# Altium project roach2_project rev2.PrjPCB (part 9 of 13)

## Sheet v6_io_27_28_32_33.SchDoc: Virtex-6 IO Banks 27, 28, 32 & 33
size A3; Date: DO NOT USE, RATHER USE PROJ OPTIONS; DrawnBy: DO NOT USE, RATHER USE PROJ OPTIONS; Engineer: DO NOT USE, RATHER USE PROJ OPTIONS; Organization: DO NOT USE, RATHER USE PROJ OPTIONS; DocumentNumber: DO NOT USE, RATHER USE PROJ OPTIONS; Revision: DO NOT USE, RATHER USE PROJ OPTIONS; SheetNumber: 16; SheetTotal: 27; SCH_Sheet_Filename: v6_io_27_28_32_33.SchDoc; CurrentTime: DO NOT USE, RATHER USE PROJ OPTIONS; Time: DO NOT USE, RATHER USE PROJ OPTIONS; DocumentFullPathAndName: DO NOT USE, RATHER USE PROJ OPTIONS; DocumentName: DO NOT USE, RATHER USE PROJ OPTIONS; ModifiedDate: DO NOT USE, RATHER USE PROJ OPTIONS; ImagePath: DO NOT USE, RATHER USE PROJ OPTIONS
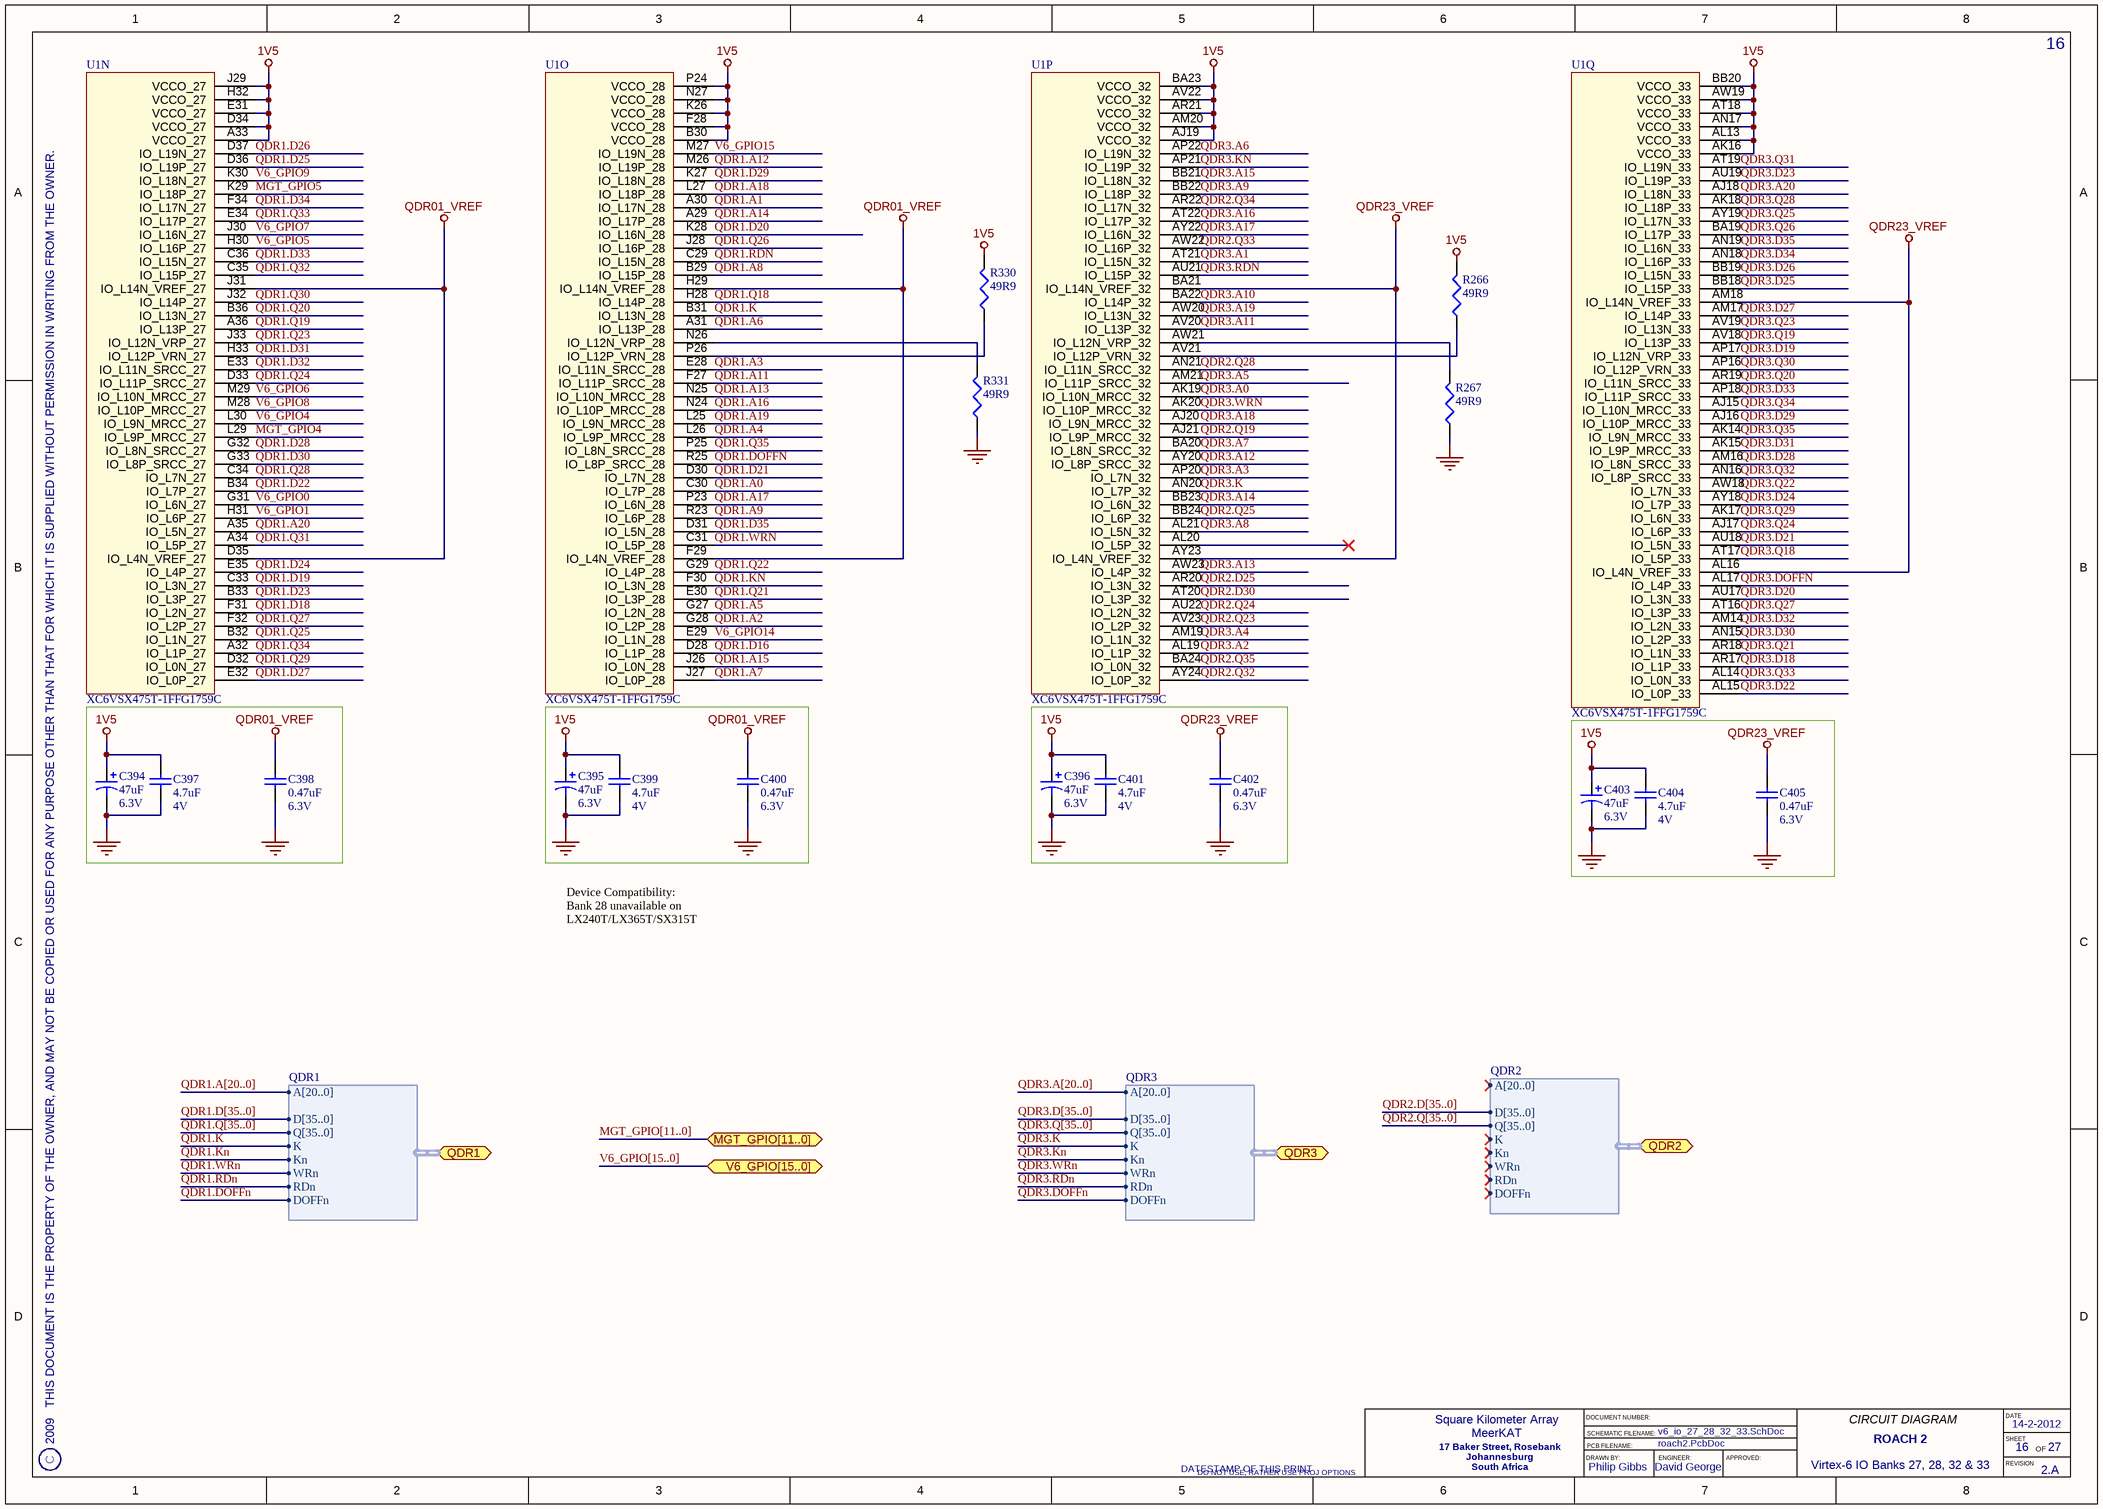
[diagram p16: v6_io_27_28_32_33.SchDoc]

### Parts
C394  Rating: 6.3V  [CAPMP3528X120L]  (hidden comment: 47uF)
C395  Rating: 6.3V  [CAPMP3528X120L]  (hidden comment: 47uF)
C396  Rating: 6.3V  [CAPMP3528X120L]  (hidden comment: 47uF)
C397  Rating: 4V  [CAPC1005X60L]  (hidden comment: 4.7uF)
C398  Rating: 6.3V  [CAPC1005X55L]  (hidden comment: 0.47uF)
C399  Rating: 4V  [CAPC1005X60L]  (hidden comment: 4.7uF)
C400  Rating: 6.3V  [CAPC1005X55L]  (hidden comment: 0.47uF)
C401  Rating: 4V  [CAPC1005X60L]  (hidden comment: 4.7uF)
C402  Rating: 6.3V  [CAPC1005X55L]  (hidden comment: 0.47uF)
C403  Rating: 6.3V  [CAPMP3528X120L]  (hidden comment: 47uF)
C404  Rating: 4V  [CAPC1005X60L]  (hidden comment: 4.7uF)
C405  Rating: 6.3V  [CAPC1005X55L]  (hidden comment: 0.47uF)
R266  49R9  [RESC1005X40L]
R267  49R9  [RESC1005X40L]
R330  49R9  [RESC1005X40L]
R331  49R9  [RESC1005X40L]
U1  XC6VSX475T-1FFG1759C  [FFG1759]  (parts N,O,P,Q of 39)

### Ports
MGT_GPIO[11..0] (bidir), QDR1 (harness QDR1), QDR2 (harness QDR2), QDR3 (harness QDR3), V6_GPIO[15..0] (bidir)

### Harnesses
QDR1: A[20..0], D[35..0], Q[35..0], K, Kn, WRn, RDn, DOFFn
QDR3: A[20..0], D[35..0], Q[35..0], K, Kn, WRn, RDn, DOFFn
QDR2: A[20..0], D[35..0], Q[35..0], K, Kn, WRn, RDn, DOFFn

### Nets
1V5: C394.1 C395.1 C396.1 C397.2 C399.2 C401.2 C403.1 C404.2 R266.2 R330.2 U1.A33(VCCO_27) U1.AJ19(VCCO_32) U1.AK16(VCCO_33) U1.AL13(VCCO_33) U1.AM20(VCCO_32) U1.AN17(VCCO_33) U1.AR21(VCCO_32) U1.AT18(VCCO_33) U1.AV22(VCCO_32) U1.AW19(VCCO_33) U1.B30(VCCO_28) U1.BA23(VCCO_32) U1.BB20(VCCO_33) U1.D34(VCCO_27) U1.E31(VCCO_27) U1.F28(VCCO_28) U1.H32(VCCO_27) U1.J29(VCCO_27) U1.K26(VCCO_28) U1.N27(VCCO_28) U1.P24(VCCO_28)
GND: C394.2 C395.2 C396.2 C397.1 C398.1 C399.1 C400.1 C401.1 C402.1 C403.2 C404.1 C405.1 R267.1 R331.1
QDR01_VREF: C398.2 C400.2 U1.D35(IO_L4N_VREF_27) U1.F29(IO_L4N_VREF_28) U1.H29(IO_L14N_VREF_28) U1.J31(IO_L14N_VREF_27)
QDR23_VREF: C402.2 C405.2 U1.AL16(IO_L4N_VREF_33) U1.AM18(IO_L14N_VREF_33) U1.AY23(IO_L4N_VREF_32) U1.BA21(IO_L14N_VREF_32)
MGT_GPIO4: U1.L29(IO_L9P_MRCC_27)
MGT_GPIO5: U1.K29(IO_L18P_27)
QDR1.A0: U1.C30(IO_L7P_28)
QDR1.A1: U1.A30(IO_L17N_28)
QDR1.A2: U1.G28(IO_L2P_28)
QDR1.A3: U1.E28(IO_L11N_SRCC_28)
QDR1.A4: U1.L26(IO_L9P_MRCC_28)
QDR1.A5: U1.G27(IO_L2N_28)
QDR1.A6: U1.A31(IO_L13P_28)
QDR1.A7: U1.J27(IO_L0P_28)
QDR1.A8: U1.B29(IO_L15P_28)
QDR1.A9: U1.R23(IO_L6P_28)
QDR1.A11: U1.F27(IO_L11P_SRCC_28)
QDR1.A12: U1.M26(IO_L19P_28)
QDR1.A13: U1.N25(IO_L10N_MRCC_28)
QDR1.A14: U1.A29(IO_L17P_28)
QDR1.A15: U1.J26(IO_L0N_28)
QDR1.A16: U1.N24(IO_L10P_MRCC_28)
QDR1.A17: U1.P23(IO_L6N_28)
QDR1.A18: U1.L27(IO_L18P_28)
QDR1.A19: U1.L25(IO_L9N_MRCC_28)
QDR1.A20: U1.A35(IO_L5N_27)
QDR1.D16: U1.D28(IO_L1P_28)
QDR1.D18: U1.F31(IO_L2N_27)
QDR1.D19: U1.C33(IO_L3N_27)
QDR1.D20: U1.K28(IO_L16N_28)
QDR1.D21: U1.D30(IO_L7N_28)
QDR1.D22: U1.B34(IO_L7P_27)
QDR1.D23: U1.B33(IO_L3P_27)
QDR1.D24: U1.E35(IO_L4P_27)
QDR1.D25: U1.D36(IO_L19P_27)
QDR1.D26: U1.D37(IO_L19N_27)
QDR1.D27: U1.E32(IO_L0P_27)
QDR1.D28: U1.G32(IO_L8N_SRCC_27)
QDR1.D29: U1.K27(IO_L18N_28)
QDR1.D30: U1.G33(IO_L8P_SRCC_27)
QDR1.D31: U1.H33(IO_L12P_VRN_27)
QDR1.D32: U1.E33(IO_L11N_SRCC_27)
QDR1.D33: U1.C36(IO_L15N_27)
QDR1.D34: U1.F34(IO_L17N_27)
QDR1.D35: U1.D31(IO_L5N_28)
QDR1.DOFFn: U1.R25(IO_L8P_SRCC_28) ; port QDR1.DOFFn
QDR1.K: U1.B31(IO_L13N_28) ; port QDR1.K
QDR1.Kn: U1.F30(IO_L3N_28) ; port QDR1.Kn
QDR1.Q18: U1.H28(IO_L14P_28)
QDR1.Q19: U1.A36(IO_L13P_27)
QDR1.Q20: U1.B36(IO_L13N_27)
QDR1.Q21: U1.E30(IO_L3P_28)
QDR1.Q22: U1.G29(IO_L4P_28)
QDR1.Q23: U1.J33(IO_L12N_VRP_27)
QDR1.Q24: U1.D33(IO_L11P_SRCC_27)
QDR1.Q25: U1.B32(IO_L1N_27)
QDR1.Q26: U1.J28(IO_L16P_28)
QDR1.Q27: U1.F32(IO_L2P_27)
QDR1.Q28: U1.C34(IO_L7N_27)
QDR1.Q29: U1.D32(IO_L0N_27)
QDR1.Q30: U1.J32(IO_L14P_27)
QDR1.Q31: U1.A34(IO_L5P_27)
QDR1.Q32: U1.C35(IO_L15P_27)
QDR1.Q33: U1.E34(IO_L17P_27)
QDR1.Q34: U1.A32(IO_L1P_27)
QDR1.Q35: U1.P25(IO_L8N_SRCC_28)
QDR1.RDn: U1.C29(IO_L15N_28) ; port QDR1.RDn
QDR1.WRn: U1.C31(IO_L5P_28) ; port QDR1.WRn
QDR2.D25: U1.AR20(IO_L3N_32)
QDR2.D30: U1.AT20(IO_L3P_32)
QDR2.Q19: U1.AJ21(IO_L9P_MRCC_32)
QDR2.Q23: U1.AV23(IO_L2P_32)
QDR2.Q24: U1.AU22(IO_L2N_32)
QDR2.Q25: U1.BB24(IO_L6P_32)
QDR2.Q28: U1.AN21(IO_L11N_SRCC_32)
QDR2.Q32: U1.AY24(IO_L0P_32)
QDR2.Q33: U1.AW22(IO_L16P_32)
QDR2.Q34: U1.AR22(IO_L17N_32)
QDR2.Q35: U1.BA24(IO_L0N_32)
QDR3.A0: U1.AK19(IO_L10N_MRCC_32)
QDR3.A1: U1.AT21(IO_L15N_32)
QDR3.A2: U1.AL19(IO_L1P_32)
QDR3.A3: U1.AP20(IO_L7N_32)
QDR3.A4: U1.AM19(IO_L1N_32)
QDR3.A5: U1.AM21(IO_L11P_SRCC_32)
QDR3.A6: U1.AP22(IO_L19N_32)
QDR3.A7: U1.BA20(IO_L8N_SRCC_32)
QDR3.A8: U1.AL21(IO_L5N_32)
QDR3.A9: U1.BB22(IO_L18P_32)
QDR3.A10: U1.BA22(IO_L14P_32)
QDR3.A11: U1.AV20(IO_L13P_32)
QDR3.A12: U1.AY20(IO_L8P_SRCC_32)
QDR3.A13: U1.AW23(IO_L4P_32)
QDR3.A14: U1.BB23(IO_L6N_32)
QDR3.A15: U1.BB21(IO_L18N_32)
QDR3.A16: U1.AT22(IO_L17P_32)
QDR3.A17: U1.AY22(IO_L16N_32)
QDR3.A18: U1.AJ20(IO_L9N_MRCC_32)
QDR3.A19: U1.AW20(IO_L13N_32)
QDR3.A20: U1.AJ18(IO_L18N_33)
QDR3.D18: U1.AR17(IO_L1P_33)
QDR3.D19: U1.AP17(IO_L12N_VRP_33)
QDR3.D20: U1.AU17(IO_L3N_33)
QDR3.D21: U1.AU18(IO_L5N_33)
QDR3.D22: U1.AL15(IO_L0P_33)
QDR3.D23: U1.AU19(IO_L19P_33)
QDR3.D24: U1.AY18(IO_L7P_33)
QDR3.D25: U1.BB18(IO_L15P_33)
QDR3.D26: U1.BB19(IO_L15N_33)
QDR3.D27: U1.AM17(IO_L14P_33)
QDR3.D28: U1.AM16(IO_L8N_SRCC_33)
QDR3.D29: U1.AJ16(IO_L10P_MRCC_33)
QDR3.D30: U1.AN15(IO_L2P_33)
QDR3.D31: U1.AK15(IO_L9P_MRCC_33)
QDR3.D32: U1.AM14(IO_L2N_33)
QDR3.D33: U1.AP18(IO_L11P_SRCC_33)
QDR3.D34: U1.AN18(IO_L16P_33)
QDR3.D35: U1.AN19(IO_L16N_33)
QDR3.DOFFn: U1.AL17(IO_L4P_33) ; port QDR3.DOFFn
QDR3.K: U1.AN20(IO_L7P_32) ; port QDR3.K
QDR3.Kn: U1.AP21(IO_L19P_32) ; port QDR3.Kn
QDR3.Q18: U1.AT17(IO_L5P_33)
QDR3.Q19: U1.AV18(IO_L13P_33)
QDR3.Q20: U1.AR19(IO_L11N_SRCC_33)
QDR3.Q21: U1.AR18(IO_L1N_33)
QDR3.Q22: U1.AW18(IO_L7N_33)
QDR3.Q23: U1.AV19(IO_L13N_33)
QDR3.Q24: U1.AJ17(IO_L6P_33)
QDR3.Q25: U1.AY19(IO_L17N_33)
QDR3.Q26: U1.BA19(IO_L17P_33)
QDR3.Q27: U1.AT16(IO_L3P_33)
QDR3.Q28: U1.AK18(IO_L18P_33)
QDR3.Q29: U1.AK17(IO_L6N_33)
QDR3.Q30: U1.AP16(IO_L12P_VRN_33)
QDR3.Q31: U1.AT19(IO_L19N_33)
QDR3.Q32: U1.AN16(IO_L8P_SRCC_33)
QDR3.Q33: U1.AL14(IO_L0N_33)
QDR3.Q34: U1.AJ15(IO_L10N_MRCC_33)
QDR3.Q35: U1.AK14(IO_L9N_MRCC_33)
QDR3.RDn: U1.AU21(IO_L15P_32) ; port QDR3.RDn
QDR3.WRn: U1.AK20(IO_L10P_MRCC_32) ; port QDR3.WRn
V6_GPIO0: U1.G31(IO_L6N_27)
V6_GPIO1: U1.H31(IO_L6P_27)
V6_GPIO4: U1.L30(IO_L9N_MRCC_27)
V6_GPIO5: U1.H30(IO_L16P_27)
V6_GPIO6: U1.M29(IO_L10N_MRCC_27)
V6_GPIO7: U1.J30(IO_L16N_27)
V6_GPIO8: U1.M28(IO_L10P_MRCC_27)
V6_GPIO9: U1.K30(IO_L18N_27)
V6_GPIO14: U1.E29(IO_L1N_28)
V6_GPIO15: U1.M27(IO_L19N_28)
NetR266_1: R266.1 U1.AV21(IO_L12P_VRN_32)
NetR267_2: R267.2 U1.AW21(IO_L12N_VRP_32)
NetR330_1: R330.1 U1.P26(IO_L12P_VRN_28)
NetR331_2: R331.2 U1.N26(IO_L12N_VRP_28)

Not connected (* = marked no-connect by the designer): U1 AL20(IO_L5P_32)*

### Buses and harness runs
bus MGT_GPIO[11..0] = port MGT_GPIO[11..0]
bus QDR1.A[20..0]
bus QDR1.D[35..0]
bus QDR1.Q[35..0]
bus QDR2.D[35..0]
bus QDR2.Q[35..0]
bus QDR3.A[20..0]
bus QDR3.D[35..0]
bus QDR3.Q[35..0]
bus V6_GPIO[15..0] = port V6_GPIO[15..0]

### Notes on the sheet
- Device Compatibility:
  Bank 28 unavailable on LX240T/LX365T/SX315T
- 2009   THIS DOCUMENT IS THE PROPERTY OF THE OWNER, AND MAY NOT BE COPIED OR USED FOR ANY PURPOSE OTHER THAN THAT FOR WHICH IT IS SUPPLIED WITHOUT PERMISSION IN WRITING FROM THE OWNER.
- C
- DATESTAMP OF THIS PRINT
- DRAWN BY:
- DOCUMENT NUMBER:
- SCHEMATIC FILENAME:
- PCB FILENAME:
- ENGINEER:
- APPROVED:
- CIRCUIT DIAGRAM
- DATE
- SHEET
- REVISION
- OF

### Library data of the parts
C394-C396 C403 = CAP-TAN-1: 47uF, Conductive Polymer Chip Capacitor; Manufacturer: KEMET; PartNum: T520T476M006ATE070; Tolerance: 20%; ESR: 0.07; POD number: CAP-TAN-1; Value: 47uF; RoHS: Y; Sort Value: 47; Category: Capacitors; Subcategory: Tantalum
C397 C399 C401 C404 = CAP-CER-11: 4.7uF, Ceramic Capacitor; Manufacturer: MURATA; PartNum: AMK105BJ475MV-F; Tolerance: 20%; Dielectric: X5R; POD number: CAP-CER-11; Value: 4.7uF; RoHS: Y; Sort Value: 4.7; Category: Capacitors; Subcategory: Ceramic
C398 C400 C402 C405 = CAP-CER-7: 0.47uF, Ceramic Capacitor; Manufacturer: MURATA; PartNum: GRM155R60J474KE19; Tolerance: 10%; Dielectric: X5R; POD number: CAP-CER-7; Value: 0.47uF; RoHS: Y; Sort Value: 0.47; Category: Capacitors; Subcategory: Ceramic
R266 R267 R330 R331 = RES-TF-10: 49R9, 1.1mm x 0.5mm, Thick Film Resistor; Manufacturer: ROYALOHM; PartNum: 0402WGF499JT1E; Tolerance: 1%; Rating: 0.0625W; POD number: RES-TF-10; Value: 49R9; Sort Value: 49.9; Category: Resistors; Subcategory: ThickFilm; HelpURL: *.pdf
U1 = IC-PLD-0: Virtex-6 475SXT 1760-pin FPGA; Manufacturer: Xilinx; POD number: IC-PLD-0; PartNum: XC6VSX475T-1FFG1759C; RoHS: Y; Category: IC; Subcategory: PLD

## Sheet v6_io_34_35_36_37_38.SchDoc: Virtex-6 IO Banks 34, 35,36,37 & 38
size A3; Date: DO NOT USE, RATHER USE PROJ OPTIONS; DrawnBy: DO NOT USE, RATHER USE PROJ OPTIONS; Engineer: DO NOT USE, RATHER USE PROJ OPTIONS; Organization: DO NOT USE, RATHER USE PROJ OPTIONS; DocumentNumber: DO NOT USE, RATHER USE PROJ OPTIONS; Revision: DO NOT USE, RATHER USE PROJ OPTIONS; SheetNumber: 17; SheetTotal: 27; SCH_Sheet_Filename: v6_io_34_35_36_37_38.SchDoc; CurrentTime: DO NOT USE, RATHER USE PROJ OPTIONS; Time: DO NOT USE, RATHER USE PROJ OPTIONS; DocumentFullPathAndName: DO NOT USE, RATHER USE PROJ OPTIONS; DocumentName: DO NOT USE, RATHER USE PROJ OPTIONS; ModifiedDate: DO NOT USE, RATHER USE PROJ OPTIONS; ImagePath: DO NOT USE, RATHER USE PROJ OPTIONS
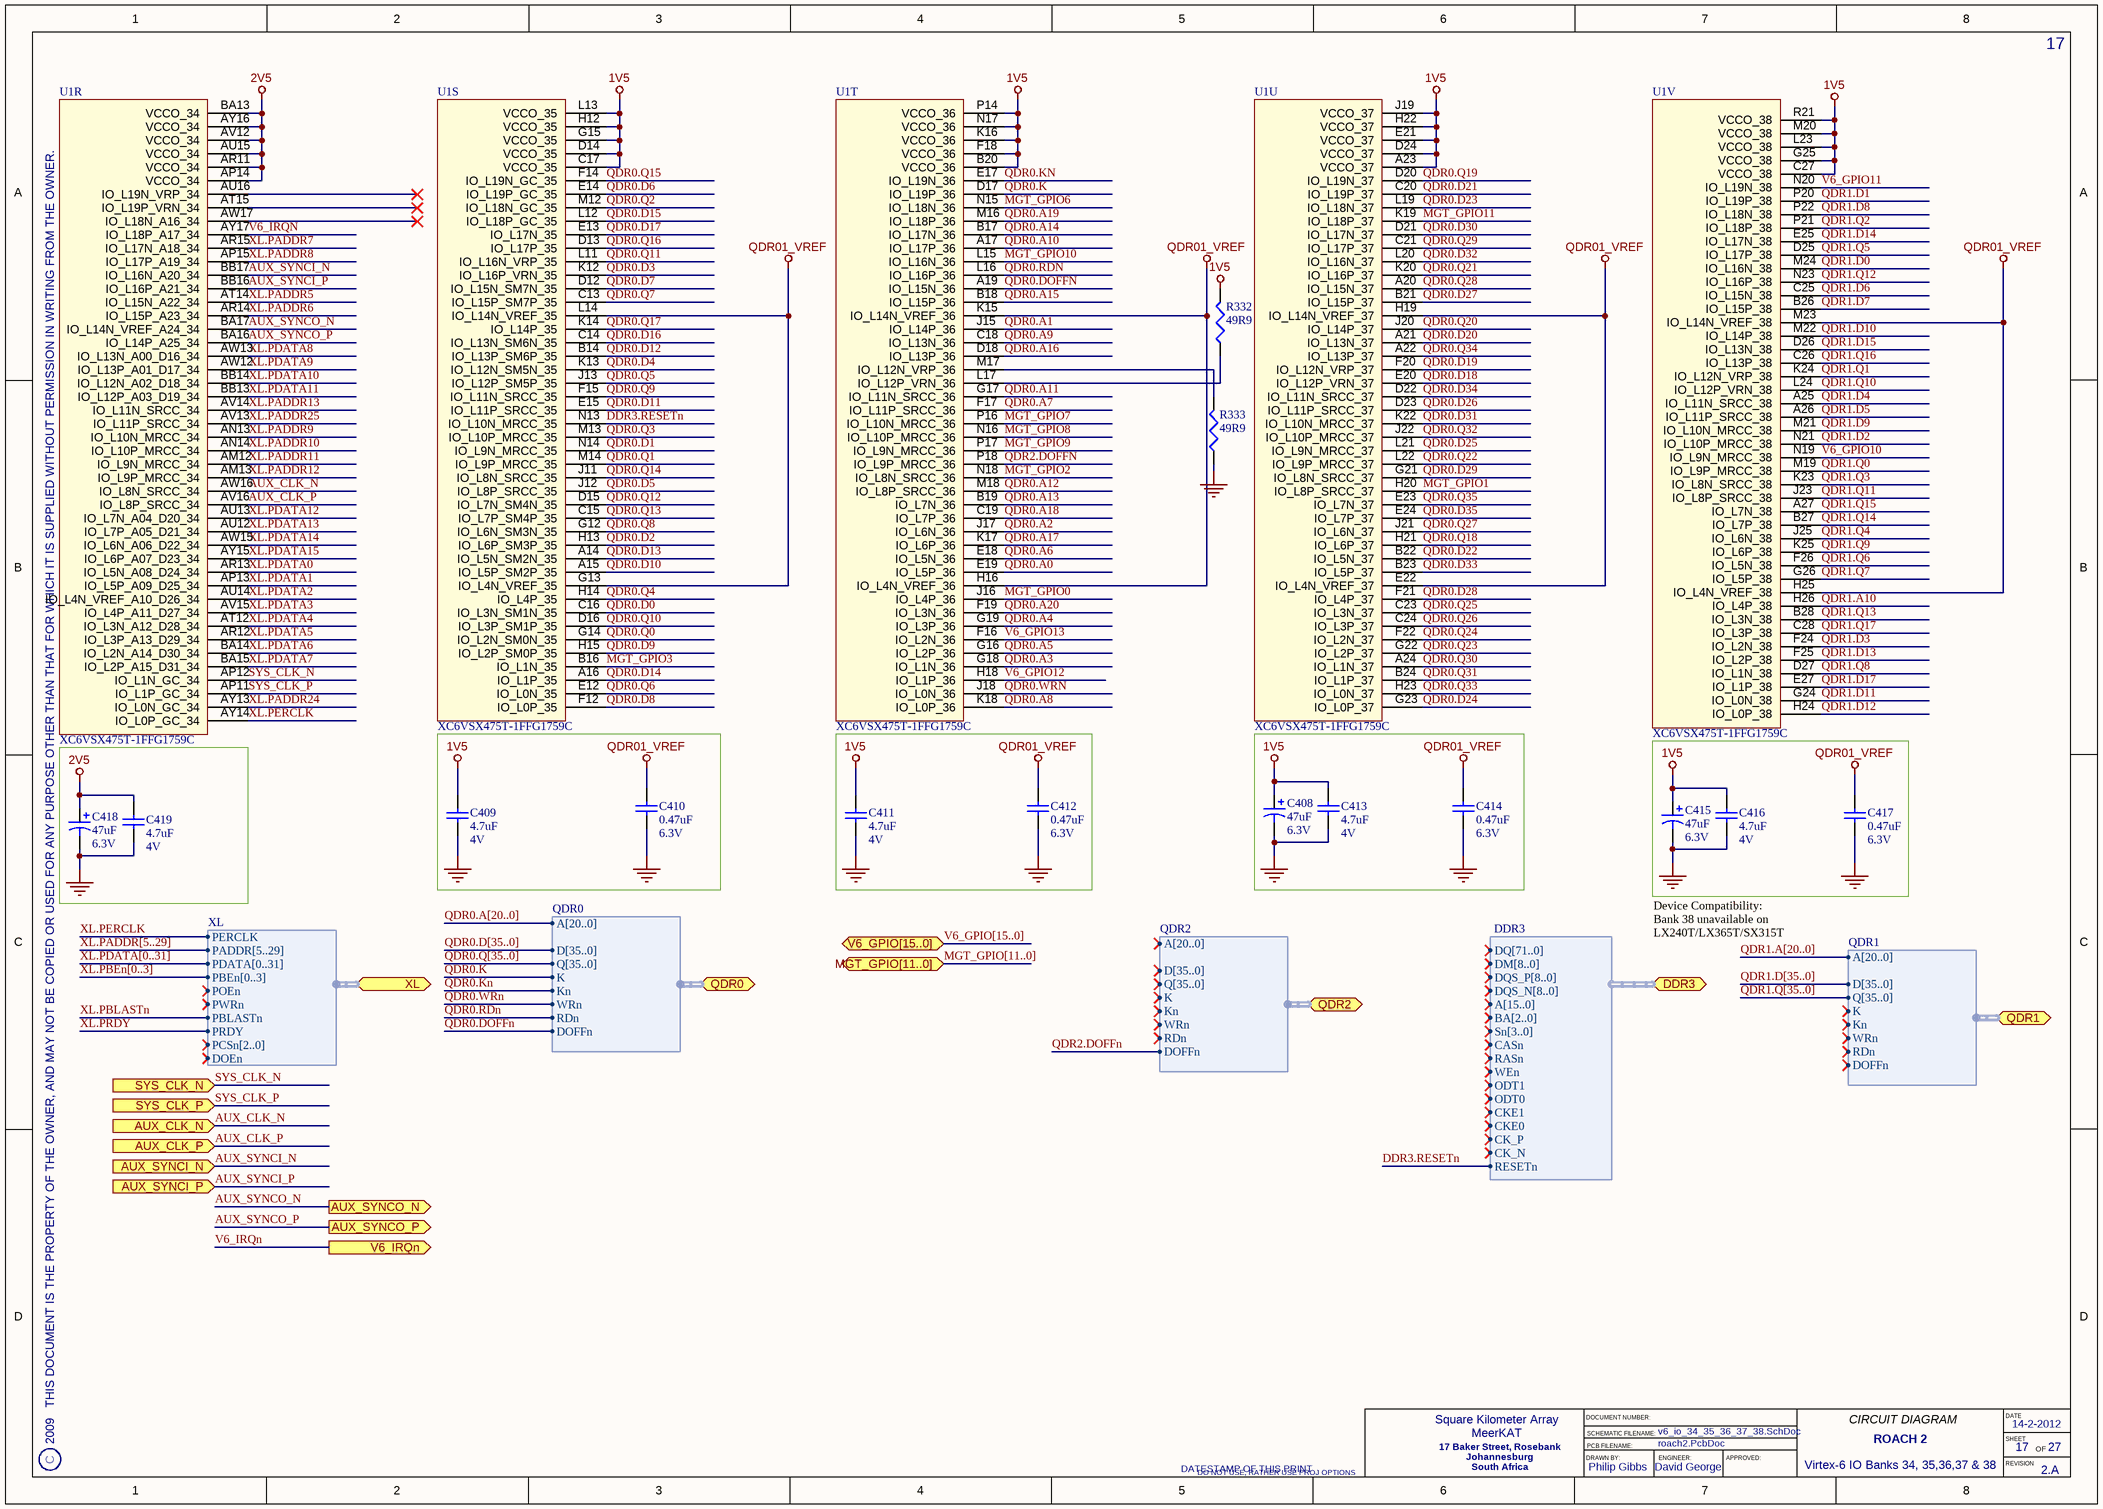
[diagram p17: v6_io_34_35_36_37_38.SchDoc]

### Parts
C408  Rating: 6.3V  [CAPMP3528X120L]  (hidden comment: 47uF)
C409  Rating: 4V  [CAPC1005X60L]  (hidden comment: 4.7uF)
C410  Rating: 6.3V  [CAPC1005X55L]  (hidden comment: 0.47uF)
C411  Rating: 4V  [CAPC1005X60L]  (hidden comment: 4.7uF)
C412  Rating: 6.3V  [CAPC1005X55L]  (hidden comment: 0.47uF)
C413  Rating: 4V  [CAPC1005X60L]  (hidden comment: 4.7uF)
C414  Rating: 6.3V  [CAPC1005X55L]  (hidden comment: 0.47uF)
C415  Rating: 6.3V  [CAPMP3528X120L]  (hidden comment: 47uF)
C416  Rating: 4V  [CAPC1005X60L]  (hidden comment: 4.7uF)
C417  Rating: 6.3V  [CAPC1005X55L]  (hidden comment: 0.47uF)
C418  Rating: 6.3V  [CAPMP3528X120L]  (hidden comment: 47uF)
C419  Rating: 4V  [CAPC1005X60L]  (hidden comment: 4.7uF)
R332  49R9  [RESC1005X40L]
R333  49R9  [RESC1005X40L]
U1  XC6VSX475T-1FFG1759C  [FFG1759]  (parts R,S,T,U,V of 39)

### Ports
AUX_CLK_N (in), AUX_CLK_P (in), AUX_SYNCI_N (in), AUX_SYNCI_P (in), AUX_SYNCO_N (out), AUX_SYNCO_P (out), DDR3 (harness DDR3), MGT_GPIO[11..0] (bidir), QDR0 (harness QDR0), QDR1 (harness QDR1), QDR2 (harness QDR2), SYS_CLK_N (in), SYS_CLK_P (in), V6_GPIO[15..0] (bidir), V6_IRQn (out), XL (harness XL)

### Harnesses
DDR3: DQ[71..0], DM[8..0], DQS_P[8..0], DQS_N[8..0], A[15..0], BA[2..0], Sn[3..0], CASn, RASn, WEn, ODT1, ODT0, CKE1, CKE0, CK_P, CK_N, RESETn
QDR0: A[20..0], D[35..0], Q[35..0], K, Kn, WRn, RDn, DOFFn
QDR2: A[20..0], D[35..0], Q[35..0], K, Kn, WRn, RDn, DOFFn
QDR1: A[20..0], D[35..0], Q[35..0], K, Kn, WRn, RDn, DOFFn
XL: PERCLK, PADDR[5..29], PDATA[0..31], PBEn[0..3], POEn, PWRn, PBLASTn, PRDY, PCSn[2..0], DOEn

### Nets
1V5: C408.1 C409.2 C411.2 C413.2 C415.1 C416.2 R332.2 U1.A23(VCCO_37) U1.B20(VCCO_36) U1.C17(VCCO_35) U1.C27(VCCO_38) U1.D14(VCCO_35) U1.D24(VCCO_37) U1.E21(VCCO_37) U1.F18(VCCO_36) U1.G15(VCCO_35) U1.G25(VCCO_38) U1.H12(VCCO_35) U1.H22(VCCO_37) U1.J19(VCCO_37) U1.K16(VCCO_36) U1.L13(VCCO_35) U1.L23(VCCO_38) U1.M20(VCCO_38) U1.N17(VCCO_36) U1.P14(VCCO_36) U1.R21(VCCO_38)
2V5: C418.1 C419.2 U1.AP14(VCCO_34) U1.AR11(VCCO_34) U1.AU15(VCCO_34) U1.AV12(VCCO_34) U1.AY16(VCCO_34) U1.BA13(VCCO_34)
GND: C408.2 C409.1 C410.1 C411.1 C412.1 C413.1 C414.1 C415.2 C416.1 C417.1 C418.2 C419.1 R333.1
QDR01_VREF: C410.2 C412.2 C414.2 C417.2 U1.E22(IO_L4N_VREF_37) U1.G13(IO_L4N_VREF_35) U1.H16(IO_L4N_VREF_36) U1.H19(IO_L14N_VREF_37) U1.H25(IO_L4N_VREF_38) U1.K15(IO_L14N_VREF_36) U1.L14(IO_L14N_VREF_35) U1.M23(IO_L14N_VREF_38)
AUX_CLK_N: U1.AW16(IO_L8N_SRCC_34) ; port AUX_CLK_N
AUX_CLK_P: U1.AV16(IO_L8P_SRCC_34) ; port AUX_CLK_P
AUX_SYNCI_N: U1.BB17(IO_L16N_A20_34) ; port AUX_SYNCI_N
AUX_SYNCI_P: U1.BB16(IO_L16P_A21_34) ; port AUX_SYNCI_P
AUX_SYNCO_N: U1.BA17(IO_L14N_VREF_A24_34) ; port AUX_SYNCO_N
AUX_SYNCO_P: U1.BA16(IO_L14P_A25_34) ; port AUX_SYNCO_P
DDR3.RESETn: U1.N13(IO_L10N_MRCC_35) ; port DDR3.RESETn
MGT_GPIO0: U1.J16(IO_L4P_36)
MGT_GPIO1: U1.H20(IO_L8P_SRCC_37)
MGT_GPIO2: U1.N18(IO_L8N_SRCC_36)
MGT_GPIO3: U1.B16(IO_L1N_35)
MGT_GPIO6: U1.N15(IO_L18N_36)
MGT_GPIO7: U1.P16(IO_L10N_MRCC_36)
MGT_GPIO8: U1.N16(IO_L10P_MRCC_36)
MGT_GPIO9: U1.P17(IO_L9N_MRCC_36)
MGT_GPIO10: U1.L15(IO_L16N_36)
MGT_GPIO11: U1.K19(IO_L18P_37)
QDR0.A0: U1.E19(IO_L5P_36)
QDR0.A1: U1.J15(IO_L14P_36)
QDR0.A2: U1.J17(IO_L6N_36)
QDR0.A3: U1.G18(IO_L1N_36)
QDR0.A4: U1.G19(IO_L3P_36)
QDR0.A5: U1.G16(IO_L2P_36)
QDR0.A6: U1.E18(IO_L5N_36)
QDR0.A7: U1.F17(IO_L11P_SRCC_36)
QDR0.A8: U1.K18(IO_L0P_36)
QDR0.A9: U1.C18(IO_L13N_36)
QDR0.A10: U1.A17(IO_L17P_36)
QDR0.A11: U1.G17(IO_L11N_SRCC_36)
QDR0.A12: U1.M18(IO_L8P_SRCC_36)
QDR0.A13: U1.B19(IO_L7N_36)
QDR0.A14: U1.B17(IO_L17N_36)
QDR0.A15: U1.B18(IO_L15P_36)
QDR0.A16: U1.D18(IO_L13P_36)
QDR0.A17: U1.K17(IO_L6P_36)
QDR0.A18: U1.C19(IO_L7P_36)
QDR0.A19: U1.M16(IO_L18P_36)
QDR0.A20: U1.F19(IO_L3N_36)
QDR0.D0: U1.C16(IO_L3N_SM1N_35)
QDR0.D1: U1.N14(IO_L9N_MRCC_35)
QDR0.D2: U1.H13(IO_L6P_SM3P_35)
QDR0.D3: U1.K12(IO_L16P_VRN_35)
QDR0.D4: U1.K13(IO_L12N_SM5N_35)
QDR0.D5: U1.J12(IO_L8P_SRCC_35)
QDR0.D6: U1.E14(IO_L19P_GC_35)
QDR0.D7: U1.D12(IO_L15N_SM7N_35)
QDR0.D8: U1.F12(IO_L0P_35)
QDR0.D9: U1.H15(IO_L2P_SM0P_35)
QDR0.D10: U1.A15(IO_L5P_SM2P_35)
QDR0.D11: U1.E15(IO_L11P_SRCC_35)
QDR0.D12: U1.B14(IO_L13P_SM6P_35)
QDR0.D13: U1.A14(IO_L5N_SM2N_35)
QDR0.D14: U1.A16(IO_L1P_35)
QDR0.D15: U1.L12(IO_L18P_GC_35)
QDR0.D16: U1.C14(IO_L13N_SM6N_35)
QDR0.D17: U1.E13(IO_L17N_35)
QDR0.D18: U1.E20(IO_L12P_VRN_37)
QDR0.D19: U1.F20(IO_L12N_VRP_37)
QDR0.D20: U1.A21(IO_L13N_37)
QDR0.D21: U1.C20(IO_L19P_37)
QDR0.D22: U1.B22(IO_L5N_37)
QDR0.D23: U1.L19(IO_L18N_37)
QDR0.D24: U1.G23(IO_L0P_37)
QDR0.D25: U1.L21(IO_L9N_MRCC_37)
QDR0.D26: U1.D23(IO_L11P_SRCC_37)
QDR0.D27: U1.B21(IO_L15P_37)
QDR0.D28: U1.F21(IO_L4P_37)
QDR0.D29: U1.G21(IO_L8N_SRCC_37)
QDR0.D30: U1.D21(IO_L17N_37)
QDR0.D31: U1.K22(IO_L10N_MRCC_37)
QDR0.D32: U1.L20(IO_L16N_37)
QDR0.D33: U1.B23(IO_L5P_37)
QDR0.D34: U1.D22(IO_L11N_SRCC_37)
QDR0.D35: U1.E24(IO_L7P_37)
QDR0.DOFFn: U1.A19(IO_L15N_36) ; port QDR0.DOFFn
QDR0.K: U1.D17(IO_L19P_36) ; port QDR0.K
QDR0.Kn: U1.E17(IO_L19N_36) ; port QDR0.Kn
QDR0.Q0: U1.G14(IO_L2N_SM0N_35)
QDR0.Q1: U1.M14(IO_L9P_MRCC_35)
QDR0.Q2: U1.M12(IO_L18N_GC_35)
QDR0.Q3: U1.M13(IO_L10P_MRCC_35)
QDR0.Q4: U1.H14(IO_L4P_35)
QDR0.Q5: U1.J13(IO_L12P_SM5P_35)
QDR0.Q6: U1.E12(IO_L0N_35)
QDR0.Q7: U1.C13(IO_L15P_SM7P_35)
QDR0.Q8: U1.G12(IO_L6N_SM3N_35)
QDR0.Q9: U1.F15(IO_L11N_SRCC_35)
QDR0.Q10: U1.D16(IO_L3P_SM1P_35)
QDR0.Q11: U1.L11(IO_L16N_VRP_35)
QDR0.Q12: U1.D15(IO_L7N_SM4N_35)
QDR0.Q13: U1.C15(IO_L7P_SM4P_35)
QDR0.Q14: U1.J11(IO_L8N_SRCC_35)
QDR0.Q15: U1.F14(IO_L19N_GC_35)
QDR0.Q16: U1.D13(IO_L17P_35)
QDR0.Q17: U1.K14(IO_L14P_35)
QDR0.Q18: U1.H21(IO_L6P_37)
QDR0.Q19: U1.D20(IO_L19N_37)
QDR0.Q20: U1.J20(IO_L14P_37)
QDR0.Q21: U1.K20(IO_L16P_37)
QDR0.Q22: U1.L22(IO_L9P_MRCC_37)
QDR0.Q23: U1.G22(IO_L2P_37)
QDR0.Q24: U1.F22(IO_L2N_37)
QDR0.Q25: U1.C23(IO_L3N_37)
QDR0.Q26: U1.C24(IO_L3P_37)
QDR0.Q27: U1.J21(IO_L6N_37)
QDR0.Q28: U1.A20(IO_L15N_37)
QDR0.Q29: U1.C21(IO_L17P_37)
QDR0.Q30: U1.A24(IO_L1N_37)
QDR0.Q31: U1.B24(IO_L1P_37)
QDR0.Q32: U1.J22(IO_L10P_MRCC_37)
QDR0.Q33: U1.H23(IO_L0N_37)
QDR0.Q34: U1.A22(IO_L13P_37)
QDR0.Q35: U1.E23(IO_L7N_37)
QDR0.RDn: U1.L16(IO_L16P_36) ; port QDR0.RDn
QDR0.WRn: U1.J18(IO_L0N_36) ; port QDR0.WRn
QDR1.A10: U1.H26(IO_L4P_38)
QDR1.D0: U1.M24(IO_L16N_38)
QDR1.D1: U1.P20(IO_L19P_38)
QDR1.D2: U1.N21(IO_L10P_MRCC_38)
QDR1.D3: U1.F24(IO_L2N_38)
QDR1.D4: U1.A25(IO_L11N_SRCC_38)
QDR1.D5: U1.A26(IO_L11P_SRCC_38)
QDR1.D6: U1.C25(IO_L15N_38)
QDR1.D7: U1.B26(IO_L15P_38)
QDR1.D8: U1.P22(IO_L18N_38)
QDR1.D9: U1.M21(IO_L10N_MRCC_38)
QDR1.D10: U1.M22(IO_L14P_38)
QDR1.D11: U1.G24(IO_L0N_38)
QDR1.D12: U1.H24(IO_L0P_38)
QDR1.D13: U1.F25(IO_L2P_38)
QDR1.D14: U1.E25(IO_L17N_38)
QDR1.D15: U1.D26(IO_L13N_38)
QDR1.D17: U1.E27(IO_L1P_38)
QDR1.Q0: U1.M19(IO_L9P_MRCC_38)
QDR1.Q1: U1.K24(IO_L12N_VRP_38)
QDR1.Q2: U1.P21(IO_L18P_38)
QDR1.Q3: U1.K23(IO_L8N_SRCC_38)
QDR1.Q4: U1.J25(IO_L6N_38)
QDR1.Q5: U1.D25(IO_L17P_38)
QDR1.Q6: U1.F26(IO_L5N_38)
QDR1.Q7: U1.G26(IO_L5P_38)
QDR1.Q8: U1.D27(IO_L1N_38)
QDR1.Q9: U1.K25(IO_L6P_38)
QDR1.Q10: U1.L24(IO_L12P_VRN_38)
QDR1.Q11: U1.J23(IO_L8P_SRCC_38)
QDR1.Q12: U1.N23(IO_L16P_38)
QDR1.Q13: U1.B28(IO_L3N_38)
QDR1.Q14: U1.B27(IO_L7P_38)
QDR1.Q15: U1.A27(IO_L7N_38)
QDR1.Q16: U1.C26(IO_L13P_38)
QDR1.Q17: U1.C28(IO_L3P_38)
QDR2.DOFFn: U1.P18(IO_L9P_MRCC_36) ; port QDR2.DOFFn
SYS_CLK_N: U1.AP12(IO_L1N_GC_34) ; port SYS_CLK_N
SYS_CLK_P: U1.AP11(IO_L1P_GC_34) ; port SYS_CLK_P
V6_GPIO10: U1.N19(IO_L9N_MRCC_38)
V6_GPIO11: U1.N20(IO_L19N_38)
V6_GPIO12: U1.H18(IO_L1P_36)
V6_GPIO13: U1.F16(IO_L2N_36)
V6_IRQn: U1.AY17(IO_L18P_A17_34) ; port V6_IRQn
XL.PADDR5: U1.AT14(IO_L15N_A22_34)
XL.PADDR6: U1.AR14(IO_L15P_A23_34)
XL.PADDR7: U1.AR15(IO_L17N_A18_34)
XL.PADDR8: U1.AP15(IO_L17P_A19_34)
XL.PADDR9: U1.AN13(IO_L10N_MRCC_34)
XL.PADDR10: U1.AN14(IO_L10P_MRCC_34)
XL.PADDR11: U1.AM12(IO_L9N_MRCC_34)
XL.PADDR12: U1.AM13(IO_L9P_MRCC_34)
XL.PADDR13: U1.AV14(IO_L11N_SRCC_34)
XL.PADDR24: U1.AY13(IO_L0N_GC_34)
XL.PADDR25: U1.AV13(IO_L11P_SRCC_34)
XL.PDATA0: U1.AR13(IO_L5N_A08_D24_34)
XL.PDATA1: U1.AP13(IO_L5P_A09_D25_34)
XL.PDATA2: U1.AU14(IO_L4N_VREF_A10_D26_34)
XL.PDATA3: U1.AV15(IO_L4P_A11_D27_34)
XL.PDATA4: U1.AT12(IO_L3N_A12_D28_34)
XL.PDATA5: U1.AR12(IO_L3P_A13_D29_34)
XL.PDATA6: U1.BA14(IO_L2N_A14_D30_34)
XL.PDATA7: U1.BA15(IO_L2P_A15_D31_34)
XL.PDATA8: U1.AW13(IO_L13N_A00_D16_34)
XL.PDATA9: U1.AW12(IO_L13P_A01_D17_34)
XL.PDATA10: U1.BB14(IO_L12N_A02_D18_34)
XL.PDATA11: U1.BB13(IO_L12P_A03_D19_34)
XL.PDATA12: U1.AU13(IO_L7N_A04_D20_34)
XL.PDATA13: U1.AU12(IO_L7P_A05_D21_34)
XL.PDATA14: U1.AW15(IO_L6N_A06_D22_34)
XL.PDATA15: U1.AY15(IO_L6P_A07_D23_34)
XL.PERCLK: U1.AY14(IO_L0P_GC_34) ; port XL.PERCLK
NetR332_1: R332.1 U1.L17(IO_L12P_VRN_36)
NetR333_2: R333.2 U1.M17(IO_L12N_VRP_36)

Not connected (* = marked no-connect by the designer): U1 AT15(IO_L19P_VRN_34)* AU16(IO_L19N_VRP_34)* AW17(IO_L18N_A16_34)*

### Buses and harness runs
bus MGT_GPIO[11..0] = port MGT_GPIO[11..0]
bus QDR0.A[20..0]
bus QDR0.D[35..0]
bus QDR0.Q[35..0]
bus QDR1.A[20..0]
bus QDR1.D[35..0]
bus QDR1.Q[35..0]
bus V6_GPIO[15..0] = port V6_GPIO[15..0]
bus XL.PADDR[5..29]
bus XL.PBEn[0..3]
bus XL.PDATA[0..31]

### Notes on the sheet
- Device Compatibility:
  Bank 38 unavailable on LX240T/LX365T/SX315T
- 2009   THIS DOCUMENT IS THE PROPERTY OF THE OWNER, AND MAY NOT BE COPIED OR USED FOR ANY PURPOSE OTHER THAN THAT FOR WHICH IT IS SUPPLIED WITHOUT PERMISSION IN WRITING FROM THE OWNER.
- C
- DATESTAMP OF THIS PRINT
- DRAWN BY:
- DOCUMENT NUMBER:
- SCHEMATIC FILENAME:
- PCB FILENAME:
- ENGINEER:
- APPROVED:
- CIRCUIT DIAGRAM
- DATE
- SHEET
- REVISION
- OF

### Library data of the parts
C408 C415 C418 = CAP-TAN-1: as C394-C396 on sheet v6_io_27_28_32_33; POD number: CAP-TAN-1; Value: 47uF; RoHS: Y; Sort Value: 47; Category: Capacitors; Subcategory: Tantalum
C409 C411 C413 C416 C419 = CAP-CER-11: as C397 on sheet v6_io_27_28_32_33; POD number: CAP-CER-11; Value: 4.7uF; RoHS: Y; Sort Value: 4.7; Category: Capacitors; Subcategory: Ceramic
C410 C412 C414 C417 = CAP-CER-7: as C398 on sheet v6_io_27_28_32_33; POD number: CAP-CER-7; Value: 0.47uF; RoHS: Y; Sort Value: 0.47; Category: Capacitors; Subcategory: Ceramic
R332 R333 = RES-TF-10: as R266 on sheet v6_io_27_28_32_33; POD number: RES-TF-10; Value: 49R9; Sort Value: 49.9; Category: Resistors; Subcategory: ThickFilm; HelpURL: *.pdf
U1 = IC-PLD-0: as U1 on sheet v6_io_27_28_32_33; POD number: IC-PLD-0; PartNum: XC6VSX475T-1FFG1759C; RoHS: Y; Category: IC; Subcategory: PLD

## Sheet zdoks.SchDoc: ZDOK Interfaces
size A3; Date: DO NOT USE, RATHER USE PROJ OPTIONS; DrawnBy: DO NOT USE, RATHER USE PROJ OPTIONS; Engineer: DO NOT USE, RATHER USE PROJ OPTIONS; Organization: DO NOT USE, RATHER USE PROJ OPTIONS; DocumentNumber: DO NOT USE, RATHER USE PROJ OPTIONS; Revision: DO NOT USE, RATHER USE PROJ OPTIONS; SheetNumber: 22; SheetTotal: 29; SCH_Sheet_Filename: zdoks.SchDoc; CurrentTime: DO NOT USE, RATHER USE PROJ OPTIONS; Time: DO NOT USE, RATHER USE PROJ OPTIONS; DocumentFullPathAndName: DO NOT USE, RATHER USE PROJ OPTIONS; DocumentName: DO NOT USE, RATHER USE PROJ OPTIONS; ModifiedDate: DO NOT USE, RATHER USE PROJ OPTIONS; ImagePath: DO NOT USE, RATHER USE PROJ OPTIONS
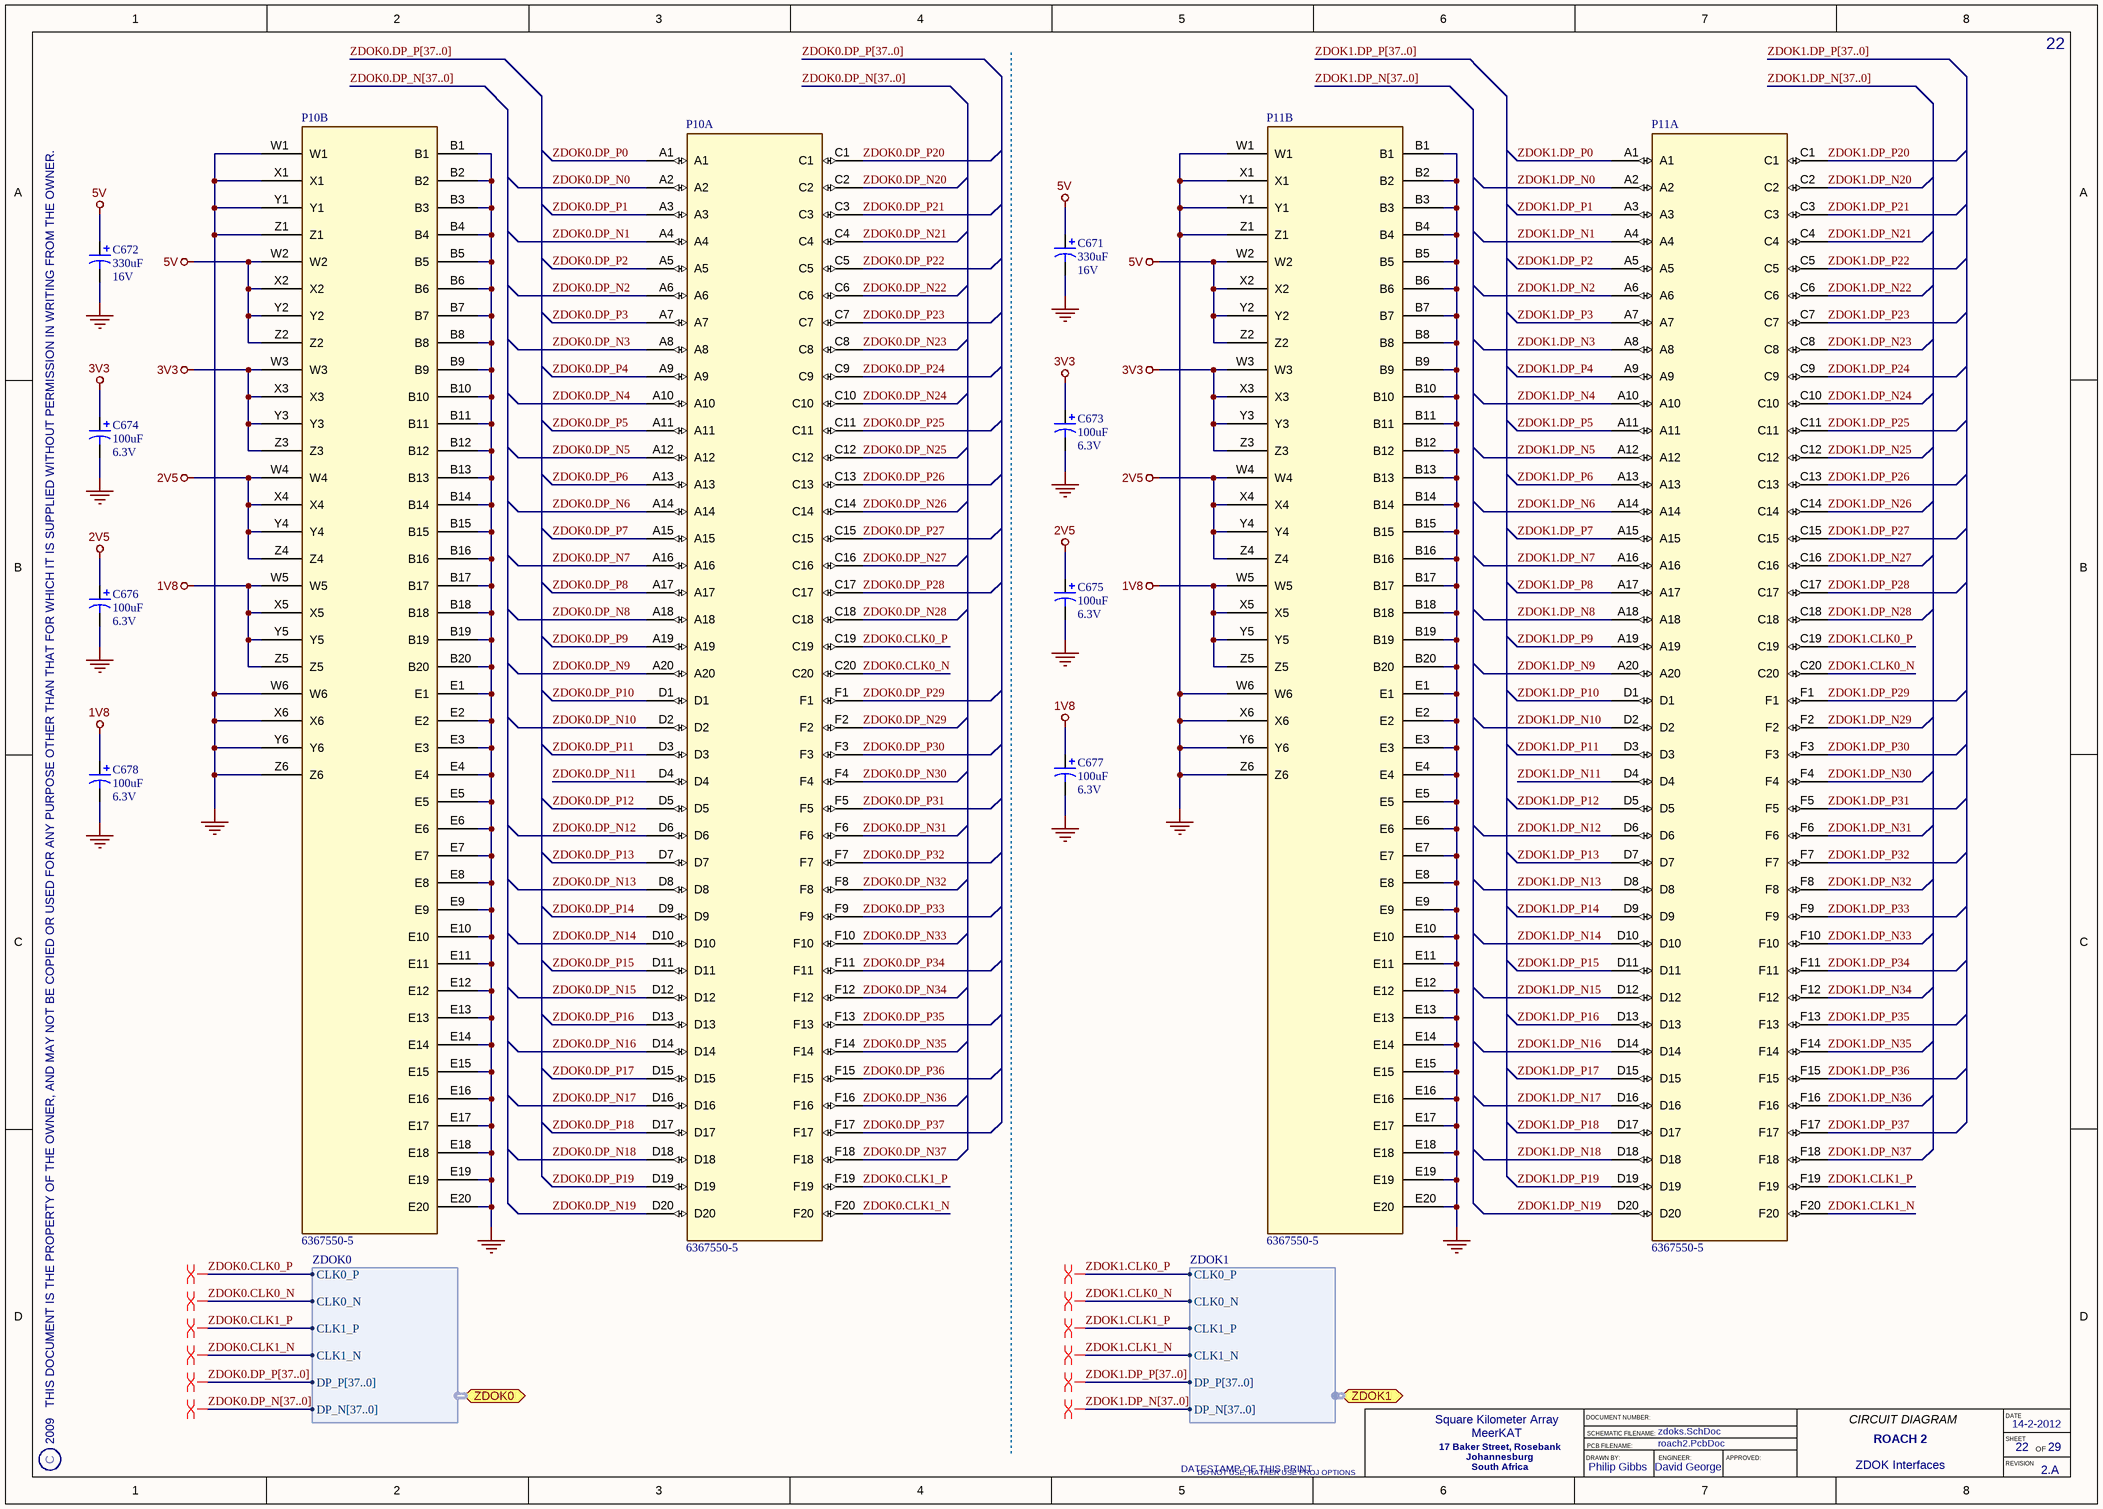
[diagram p18: zdoks.SchDoc]

### Parts
C671  Rating: 16V  [CAPMP7263X380L]  (hidden comment: 330uF)
C672  Rating: 16V  [CAPMP7263X380L]  (hidden comment: 330uF)
C673  Rating: 6.3V  [CAPMP3528X210L]  (hidden comment: 100uF)
C674  Rating: 6.3V  [CAPMP3528X210L]  (hidden comment: 100uF)
C675  Rating: 6.3V  [CAPMP3528X210L]  (hidden comment: 100uF)
C676  Rating: 6.3V  [CAPMP3528X210L]  (hidden comment: 100uF)
C677  Rating: 6.3V  [CAPMP3528X210L]  (hidden comment: 100uF)
C678  Rating: 6.3V  [CAPMP3528X210L]  (hidden comment: 100uF)
P10  6367550-5  [TYCO_6367550-5]  (parts A,B of 2)
P11  6367550-5  [TYCO_6367550-5]  (parts A,B of 2)

### Ports
ZDOK0 (harness ZDOK0), ZDOK1 (harness ZDOK1)

### Harnesses
ZDOK0: CLK0_P, CLK0_N, CLK1_P, CLK1_N, DP_P[37..0], DP_N[37..0]
ZDOK1: CLK0_P, CLK0_N, CLK1_P, CLK1_N, DP_P[37..0], DP_N[37..0]

### Nets
1V8: C677.1 C678.1 P10.W5 P10.X5 P10.Y5 P10.Z5 P11.W5 P11.X5 P11.Y5 P11.Z5
2V5: C675.1 C676.1 P10.W4 P10.X4 P10.Y4 P10.Z4 P11.W4 P11.X4 P11.Y4 P11.Z4
3V3: C673.1 C674.1 P10.W3 P10.X3 P10.Y3 P10.Z3 P11.W3 P11.X3 P11.Y3 P11.Z3
5V: C671.1 C672.1 P10.W2 P10.X2 P10.Y2 P10.Z2 P11.W2 P11.X2 P11.Y2 P11.Z2
GND: C671.2 C672.2 C673.2 C674.2 C675.2 C676.2 C677.2 C678.2 P10.B1 P10.B2 P10.B3 P10.B4 P10.B5 P10.B6 P10.B7 P10.B8 P10.B9 P10.B10 P10.B11 P10.B12 P10.B13 P10.B14 P10.B15 P10.B16 P10.B17 P10.B18 P10.B19 P10.B20 P10.E1 P10.E2 P10.E3 P10.E4 P10.E5 P10.E6 P10.E7 P10.E8 P10.E9 P10.E10 P10.E11 P10.E12 P10.E13 P10.E14 P10.E15 P10.E16 P10.E17 P10.E18 P10.E19 P10.E20 P10.W1 P10.W6 P10.X1 P10.X6 P10.Y1 P10.Y6 P10.Z1 P10.Z6 P11.B1 P11.B2 P11.B3 P11.B4 P11.B5 P11.B6 P11.B7 P11.B8 P11.B9 P11.B10 P11.B11 P11.B12 P11.B13 P11.B14 P11.B15 P11.B16 P11.B17 P11.B18 P11.B19 P11.B20 P11.E1 P11.E2 P11.E3 P11.E4 P11.E5 P11.E6 P11.E7 P11.E8 P11.E9 P11.E10 P11.E11 P11.E12 P11.E13 P11.E14 P11.E15 P11.E16 P11.E17 P11.E18 P11.E19 P11.E20 P11.W1 P11.W6 P11.X1 P11.X6 P11.Y1 P11.Y6 P11.Z1 P11.Z6
ZDOK0.CLK0_N: P10.C20 ; port ZDOK0.CLK0_N
ZDOK0.CLK0_P: P10.C19 ; port ZDOK0.CLK0_P
ZDOK0.CLK1_N: P10.F20 ; port ZDOK0.CLK1_N
ZDOK0.CLK1_P: P10.F19 ; port ZDOK0.CLK1_P
ZDOK0.DP_N0: P10.A2
ZDOK0.DP_N1: P10.A4
ZDOK0.DP_N2: P10.A6
ZDOK0.DP_N3: P10.A8
ZDOK0.DP_N4: P10.A10
ZDOK0.DP_N5: P10.A12
ZDOK0.DP_N6: P10.A14
ZDOK0.DP_N7: P10.A16
ZDOK0.DP_N8: P10.A18
ZDOK0.DP_N9: P10.A20
ZDOK0.DP_N10: P10.D2
ZDOK0.DP_N11: P10.D4
ZDOK0.DP_N12: P10.D6
ZDOK0.DP_N13: P10.D8
ZDOK0.DP_N14: P10.D10
ZDOK0.DP_N15: P10.D12
ZDOK0.DP_N16: P10.D14
ZDOK0.DP_N17: P10.D16
ZDOK0.DP_N18: P10.D18
ZDOK0.DP_N19: P10.D20
ZDOK0.DP_N20: P10.C2
ZDOK0.DP_N21: P10.C4
ZDOK0.DP_N22: P10.C6
ZDOK0.DP_N23: P10.C8
ZDOK0.DP_N24: P10.C10
ZDOK0.DP_N25: P10.C12
ZDOK0.DP_N26: P10.C14
ZDOK0.DP_N27: P10.C16
ZDOK0.DP_N28: P10.C18
ZDOK0.DP_N29: P10.F2
ZDOK0.DP_N30: P10.F4
ZDOK0.DP_N31: P10.F6
ZDOK0.DP_N32: P10.F8
ZDOK0.DP_N33: P10.F10
ZDOK0.DP_N34: P10.F12
ZDOK0.DP_N35: P10.F14
ZDOK0.DP_N36: P10.F16
ZDOK0.DP_N37: P10.F18
ZDOK0.DP_P0: P10.A1
ZDOK0.DP_P1: P10.A3
ZDOK0.DP_P2: P10.A5
ZDOK0.DP_P3: P10.A7
ZDOK0.DP_P4: P10.A9
ZDOK0.DP_P5: P10.A11
ZDOK0.DP_P6: P10.A13
ZDOK0.DP_P7: P10.A15
ZDOK0.DP_P8: P10.A17
ZDOK0.DP_P9: P10.A19
ZDOK0.DP_P10: P10.D1
ZDOK0.DP_P11: P10.D3
ZDOK0.DP_P12: P10.D5
ZDOK0.DP_P13: P10.D7
ZDOK0.DP_P14: P10.D9
ZDOK0.DP_P15: P10.D11
ZDOK0.DP_P16: P10.D13
ZDOK0.DP_P17: P10.D15
ZDOK0.DP_P18: P10.D17
ZDOK0.DP_P19: P10.D19
ZDOK0.DP_P20: P10.C1
ZDOK0.DP_P21: P10.C3
ZDOK0.DP_P22: P10.C5
ZDOK0.DP_P23: P10.C7
ZDOK0.DP_P24: P10.C9
ZDOK0.DP_P25: P10.C11
ZDOK0.DP_P26: P10.C13
ZDOK0.DP_P27: P10.C15
ZDOK0.DP_P28: P10.C17
ZDOK0.DP_P29: P10.F1
ZDOK0.DP_P30: P10.F3
ZDOK0.DP_P31: P10.F5
ZDOK0.DP_P32: P10.F7
ZDOK0.DP_P33: P10.F9
ZDOK0.DP_P34: P10.F11
ZDOK0.DP_P35: P10.F13
ZDOK0.DP_P36: P10.F15
ZDOK0.DP_P37: P10.F17
ZDOK1.CLK0_N: P11.C20 ; port ZDOK1.CLK0_N
ZDOK1.CLK0_P: P11.C19 ; port ZDOK1.CLK0_P
ZDOK1.CLK1_N: P11.F20 ; port ZDOK1.CLK1_N
ZDOK1.CLK1_P: P11.F19 ; port ZDOK1.CLK1_P
ZDOK1.DP_N0: P11.A2
ZDOK1.DP_N1: P11.A4
ZDOK1.DP_N2: P11.A6
ZDOK1.DP_N3: P11.A8
ZDOK1.DP_N4: P11.A10
ZDOK1.DP_N5: P11.A12
ZDOK1.DP_N6: P11.A14
ZDOK1.DP_N7: P11.A16
ZDOK1.DP_N8: P11.A18
ZDOK1.DP_N9: P11.A20
ZDOK1.DP_N10: P11.D2
ZDOK1.DP_N11: P11.D4
ZDOK1.DP_N12: P11.D6
ZDOK1.DP_N13: P11.D8
ZDOK1.DP_N14: P11.D10
ZDOK1.DP_N15: P11.D12
ZDOK1.DP_N16: P11.D14
ZDOK1.DP_N17: P11.D16
ZDOK1.DP_N18: P11.D18
ZDOK1.DP_N19: P11.D20
ZDOK1.DP_N20: P11.C2
ZDOK1.DP_N21: P11.C4
ZDOK1.DP_N22: P11.C6
ZDOK1.DP_N23: P11.C8
ZDOK1.DP_N24: P11.C10
ZDOK1.DP_N25: P11.C12
ZDOK1.DP_N26: P11.C14
ZDOK1.DP_N27: P11.C16
ZDOK1.DP_N28: P11.C18
ZDOK1.DP_N29: P11.F2
ZDOK1.DP_N30: P11.F4
ZDOK1.DP_N31: P11.F6
ZDOK1.DP_N32: P11.F8
ZDOK1.DP_N33: P11.F10
ZDOK1.DP_N34: P11.F12
ZDOK1.DP_N35: P11.F14
ZDOK1.DP_N36: P11.F16
ZDOK1.DP_N37: P11.F18
ZDOK1.DP_P0: P11.A1
ZDOK1.DP_P1: P11.A3
ZDOK1.DP_P2: P11.A5
ZDOK1.DP_P3: P11.A7
ZDOK1.DP_P4: P11.A9
ZDOK1.DP_P5: P11.A11
ZDOK1.DP_P6: P11.A13
ZDOK1.DP_P7: P11.A15
ZDOK1.DP_P8: P11.A17
ZDOK1.DP_P9: P11.A19
ZDOK1.DP_P10: P11.D1
ZDOK1.DP_P11: P11.D3
ZDOK1.DP_P12: P11.D5
ZDOK1.DP_P13: P11.D7
ZDOK1.DP_P14: P11.D9
ZDOK1.DP_P15: P11.D11
ZDOK1.DP_P16: P11.D13
ZDOK1.DP_P17: P11.D15
ZDOK1.DP_P18: P11.D17
ZDOK1.DP_P19: P11.D19
ZDOK1.DP_P20: P11.C1
ZDOK1.DP_P21: P11.C3
ZDOK1.DP_P22: P11.C5
ZDOK1.DP_P23: P11.C7
ZDOK1.DP_P24: P11.C9
ZDOK1.DP_P25: P11.C11
ZDOK1.DP_P26: P11.C13
ZDOK1.DP_P27: P11.C15
ZDOK1.DP_P28: P11.C17
ZDOK1.DP_P29: P11.F1
ZDOK1.DP_P30: P11.F3
ZDOK1.DP_P31: P11.F5
ZDOK1.DP_P32: P11.F7
ZDOK1.DP_P33: P11.F9
ZDOK1.DP_P34: P11.F11
ZDOK1.DP_P35: P11.F13
ZDOK1.DP_P36: P11.F15
ZDOK1.DP_P37: P11.F17

### Buses and harness runs
bus ZDOK0.DP_N[37..0]
bus ZDOK0.DP_P[37..0]
bus ZDOK1.DP_N[37..0]
bus ZDOK1.DP_P[37..0]

### Layout directives
differential pair: (no net found under the mark), ZDOK0.CLK0_N, ZDOK0.CLK0_P, ZDOK0.CLK1_N, ZDOK0.CLK1_P, ZDOK1.CLK0_N, ZDOK1.CLK0_P, ZDOK1.CLK1_N, ZDOK1.CLK1_P

### Notes on the sheet
- 2009   THIS DOCUMENT IS THE PROPERTY OF THE OWNER, AND MAY NOT BE COPIED OR USED FOR ANY PURPOSE OTHER THAN THAT FOR WHICH IT IS SUPPLIED WITHOUT PERMISSION IN WRITING FROM THE OWNER.
- C
- DATESTAMP OF THIS PRINT
- DRAWN BY:
- DOCUMENT NUMBER:
- SCHEMATIC FILENAME:
- PCB FILENAME:
- ENGINEER:
- APPROVED:
- CIRCUIT DIAGRAM
- DATE
- SHEET
- REVISION
- OF

### Library data of the parts
C671 C672 = CAP-TAN-3: 330uF, Solid Tantalum Chip Capacitor; Manufacturer: VISHAY; PartNum: 594D337X0016R2T; Tolerance: 20%; ESR: 0.055; POD number: CAP-TAN-3; Value: 330uF; RoHS: Y; Sort Value: 330; Category: Capacitors; Subcategory: Tantalum
C673-C678 = CAP-TAN-6: 100uF, Low ESR, Tantalum Capacitor; Manufacturer: AVX; PartNum: TPSB107M006R0200; Tolerance: 20%; ESR: 0.2; POD number: CAP-TAN-6; Value: 100uF; RoHS: Y; Sort Value: 100; Category: Capacitors; Subcategory: Tantalum
P10 P11 = CONN-PCB-8: ZDOK+ Host Board Connector; Manufacturer: TYCO; POD number: CONN-PCB-8; PartNum: 6367550-5; RoHS: Y; Category: CONN; Subcategory: PCB

## Sheet ppc_power.SchDoc: PowerPC Power Input
size A3; Date: DO NOT USE, RATHER USE PROJ OPTIONS; DrawnBy: DO NOT USE, RATHER USE PROJ OPTIONS; Engineer: DO NOT USE, RATHER USE PROJ OPTIONS; Organization: DO NOT USE, RATHER USE PROJ OPTIONS; DocumentNumber: DO NOT USE, RATHER USE PROJ OPTIONS; Revision: DO NOT USE, RATHER USE PROJ OPTIONS; SheetNumber: 4; SheetTotal: 29; SCH_Sheet_Filename: ppc_power.SchDoc; CurrentTime: DO NOT USE, RATHER USE PROJ OPTIONS; Time: DO NOT USE, RATHER USE PROJ OPTIONS; DocumentFullPathAndName: DO NOT USE, RATHER USE PROJ OPTIONS; DocumentName: DO NOT USE, RATHER USE PROJ OPTIONS; ModifiedDate: DO NOT USE, RATHER USE PROJ OPTIONS; ImagePath: DO NOT USE, RATHER USE PROJ OPTIONS
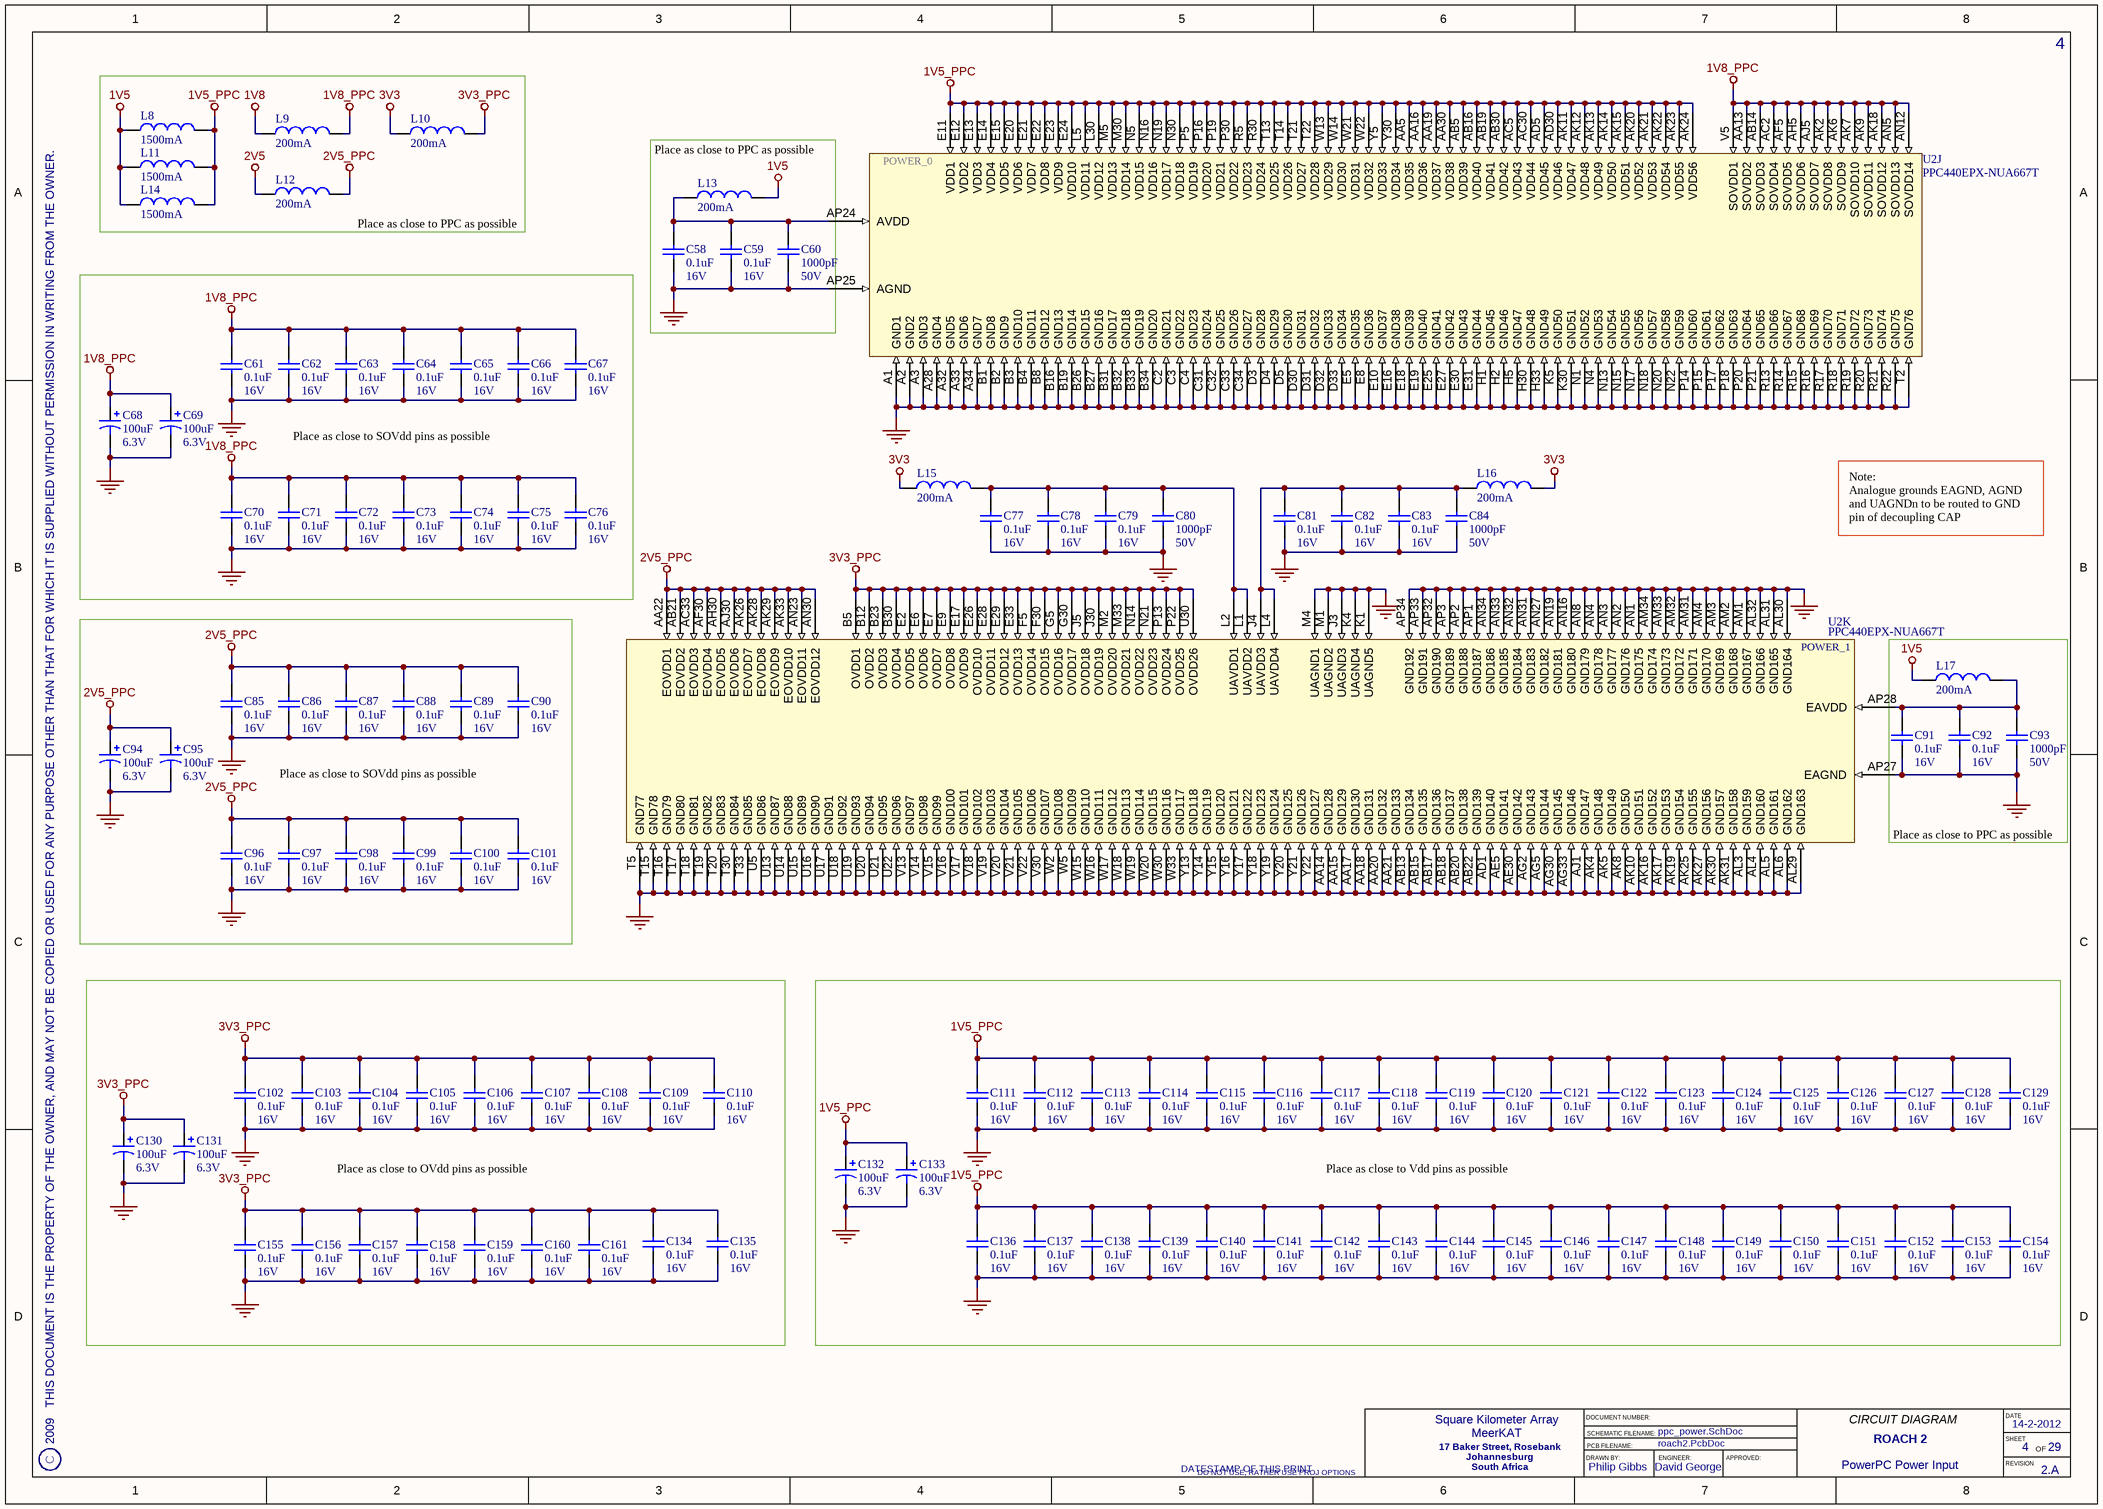
[diagram p19: ppc_power.SchDoc]

### Parts
C58  Rating: 16V  [CAPC1005X60L]  (hidden comment: 0.1uF)
C59  Rating: 16V  [CAPC1005X60L]  (hidden comment: 0.1uF)
C60  Rating: 50V  [CAPC1005X55L]  (hidden comment: 1000pF)
C61  Rating: 16V  [CAPC1005X60L]  (hidden comment: 0.1uF)
C62  Rating: 16V  [CAPC1005X60L]  (hidden comment: 0.1uF)
C63  Rating: 16V  [CAPC1005X60L]  (hidden comment: 0.1uF)
C64  Rating: 16V  [CAPC1005X60L]  (hidden comment: 0.1uF)
C65  Rating: 16V  [CAPC1005X60L]  (hidden comment: 0.1uF)
C66  Rating: 16V  [CAPC1005X60L]  (hidden comment: 0.1uF)
C67  Rating: 16V  [CAPC1005X60L]  (hidden comment: 0.1uF)
C68  Rating: 6.3V  [CAPMP3528X210L]  (hidden comment: 100uF)
C69  Rating: 6.3V  [CAPMP3528X210L]  (hidden comment: 100uF)
C70  Rating: 16V  [CAPC1005X60L]  (hidden comment: 0.1uF)
C71  Rating: 16V  [CAPC1005X60L]  (hidden comment: 0.1uF)
C72  Rating: 16V  [CAPC1005X60L]  (hidden comment: 0.1uF)
C73  Rating: 16V  [CAPC1005X60L]  (hidden comment: 0.1uF)
C74  Rating: 16V  [CAPC1005X60L]  (hidden comment: 0.1uF)
C75  Rating: 16V  [CAPC1005X60L]  (hidden comment: 0.1uF)
C76  Rating: 16V  [CAPC1005X60L]  (hidden comment: 0.1uF)
C77  Rating: 16V  [CAPC1005X60L]  (hidden comment: 0.1uF)
C78  Rating: 16V  [CAPC1005X60L]  (hidden comment: 0.1uF)
C79  Rating: 16V  [CAPC1005X60L]  (hidden comment: 0.1uF)
C80  Rating: 50V  [CAPC1005X55L]  (hidden comment: 1000pF)
C81  Rating: 16V  [CAPC1005X60L]  (hidden comment: 0.1uF)
C82  Rating: 16V  [CAPC1005X60L]  (hidden comment: 0.1uF)
C83  Rating: 16V  [CAPC1005X60L]  (hidden comment: 0.1uF)
C84  Rating: 50V  [CAPC1005X55L]  (hidden comment: 1000pF)
C85  Rating: 16V  [CAPC1005X60L]  (hidden comment: 0.1uF)
C86  Rating: 16V  [CAPC1005X60L]  (hidden comment: 0.1uF)
C87  Rating: 16V  [CAPC1005X60L]  (hidden comment: 0.1uF)
C88  Rating: 16V  [CAPC1005X60L]  (hidden comment: 0.1uF)
C89  Rating: 16V  [CAPC1005X60L]  (hidden comment: 0.1uF)
C90  Rating: 16V  [CAPC1005X60L]  (hidden comment: 0.1uF)
C91  Rating: 16V  [CAPC1005X60L]  (hidden comment: 0.1uF)
C92  Rating: 16V  [CAPC1005X60L]  (hidden comment: 0.1uF)
C93  Rating: 50V  [CAPC1005X55L]  (hidden comment: 1000pF)
C94  Rating: 6.3V  [CAPMP3528X210L]  (hidden comment: 100uF)
C95  Rating: 6.3V  [CAPMP3528X210L]  (hidden comment: 100uF)
C96  Rating: 16V  [CAPC1005X60L]  (hidden comment: 0.1uF)
C97  Rating: 16V  [CAPC1005X60L]  (hidden comment: 0.1uF)
C98  Rating: 16V  [CAPC1005X60L]  (hidden comment: 0.1uF)
C99  Rating: 16V  [CAPC1005X60L]  (hidden comment: 0.1uF)
C100  Rating: 16V  [CAPC1005X60L]  (hidden comment: 0.1uF)
C101  Rating: 16V  [CAPC1005X60L]  (hidden comment: 0.1uF)
C102  Rating: 16V  [CAPC1005X60L]  (hidden comment: 0.1uF)
C103  Rating: 16V  [CAPC1005X60L]  (hidden comment: 0.1uF)
C104  Rating: 16V  [CAPC1005X60L]  (hidden comment: 0.1uF)
C105  Rating: 16V  [CAPC1005X60L]  (hidden comment: 0.1uF)
C106  Rating: 16V  [CAPC1005X60L]  (hidden comment: 0.1uF)
C107  Rating: 16V  [CAPC1005X60L]  (hidden comment: 0.1uF)
C108  Rating: 16V  [CAPC1005X60L]  (hidden comment: 0.1uF)
C109  Rating: 16V  [CAPC1005X60L]  (hidden comment: 0.1uF)
C110  Rating: 16V  [CAPC1005X60L]  (hidden comment: 0.1uF)
C111  Rating: 16V  [CAPC1005X60L]  (hidden comment: 0.1uF)
C112  Rating: 16V  [CAPC1005X60L]  (hidden comment: 0.1uF)
C113  Rating: 16V  [CAPC1005X60L]  (hidden comment: 0.1uF)
C114  Rating: 16V  [CAPC1005X60L]  (hidden comment: 0.1uF)
C115  Rating: 16V  [CAPC1005X60L]  (hidden comment: 0.1uF)
C116  Rating: 16V  [CAPC1005X60L]  (hidden comment: 0.1uF)
C117  Rating: 16V  [CAPC1005X60L]  (hidden comment: 0.1uF)
C118  Rating: 16V  [CAPC1005X60L]  (hidden comment: 0.1uF)
C119  Rating: 16V  [CAPC1005X60L]  (hidden comment: 0.1uF)
C120  Rating: 16V  [CAPC1005X60L]  (hidden comment: 0.1uF)
C121  Rating: 16V  [CAPC1005X60L]  (hidden comment: 0.1uF)
C122  Rating: 16V  [CAPC1005X60L]  (hidden comment: 0.1uF)
C123  Rating: 16V  [CAPC1005X60L]  (hidden comment: 0.1uF)
C124  Rating: 16V  [CAPC1005X60L]  (hidden comment: 0.1uF)
C125  Rating: 16V  [CAPC1005X60L]  (hidden comment: 0.1uF)
C126  Rating: 16V  [CAPC1005X60L]  (hidden comment: 0.1uF)
C127  Rating: 16V  [CAPC1005X60L]  (hidden comment: 0.1uF)
C128  Rating: 16V  [CAPC1005X60L]  (hidden comment: 0.1uF)
C129  Rating: 16V  [CAPC1005X60L]  (hidden comment: 0.1uF)
C130  Rating: 6.3V  [CAPMP3528X210L]  (hidden comment: 100uF)
C131  Rating: 6.3V  [CAPMP3528X210L]  (hidden comment: 100uF)
C132  Rating: 6.3V  [CAPMP3528X210L]  (hidden comment: 100uF)
C133  Rating: 6.3V  [CAPMP3528X210L]  (hidden comment: 100uF)
C134  Rating: 16V  [CAPC1005X60L]  (hidden comment: 0.1uF)
C135  Rating: 16V  [CAPC1005X60L]  (hidden comment: 0.1uF)
C136  Rating: 16V  [CAPC1005X60L]  (hidden comment: 0.1uF)
C137  Rating: 16V  [CAPC1005X60L]  (hidden comment: 0.1uF)
C138  Rating: 16V  [CAPC1005X60L]  (hidden comment: 0.1uF)
C139  Rating: 16V  [CAPC1005X60L]  (hidden comment: 0.1uF)
C140  Rating: 16V  [CAPC1005X60L]  (hidden comment: 0.1uF)
C141  Rating: 16V  [CAPC1005X60L]  (hidden comment: 0.1uF)
C142  Rating: 16V  [CAPC1005X60L]  (hidden comment: 0.1uF)
C143  Rating: 16V  [CAPC1005X60L]  (hidden comment: 0.1uF)
C144  Rating: 16V  [CAPC1005X60L]  (hidden comment: 0.1uF)
C145  Rating: 16V  [CAPC1005X60L]  (hidden comment: 0.1uF)
C146  Rating: 16V  [CAPC1005X60L]  (hidden comment: 0.1uF)
C147  Rating: 16V  [CAPC1005X60L]  (hidden comment: 0.1uF)
C148  Rating: 16V  [CAPC1005X60L]  (hidden comment: 0.1uF)
C149  Rating: 16V  [CAPC1005X60L]  (hidden comment: 0.1uF)
C150  Rating: 16V  [CAPC1005X60L]  (hidden comment: 0.1uF)
C151  Rating: 16V  [CAPC1005X60L]  (hidden comment: 0.1uF)
C152  Rating: 16V  [CAPC1005X60L]  (hidden comment: 0.1uF)
C153  Rating: 16V  [CAPC1005X60L]  (hidden comment: 0.1uF)
C154  Rating: 16V  [CAPC1005X60L]  (hidden comment: 0.1uF)
C155  Rating: 16V  [CAPC1005X60L]  (hidden comment: 0.1uF)
C156  Rating: 16V  [CAPC1005X60L]  (hidden comment: 0.1uF)
C157  Rating: 16V  [CAPC1005X60L]  (hidden comment: 0.1uF)
C158  Rating: 16V  [CAPC1005X60L]  (hidden comment: 0.1uF)
C159  Rating: 16V  [CAPC1005X60L]  (hidden comment: 0.1uF)
C160  Rating: 16V  [CAPC1005X60L]  (hidden comment: 0.1uF)
C161  Rating: 16V  [CAPC1005X60L]  (hidden comment: 0.1uF)
L8  Rating: 1500mA  [INDC1608X130L]  (hidden comment: 180R)
L9  Rating: 200mA  [INDC2012X130L]  (hidden comment: 600R)
L10  Rating: 200mA  [INDC2012X130L]  (hidden comment: 600R)
L11  Rating: 1500mA  [INDC1608X130L]  (hidden comment: 180R)
L12  Rating: 200mA  [INDC2012X130L]  (hidden comment: 600R)
L13  Rating: 200mA  [INDC2012X130L]  (hidden comment: 600R)
L14  Rating: 1500mA  [INDC1608X130L]  (hidden comment: 180R)
L15  Rating: 200mA  [INDC2012X130L]  (hidden comment: 600R)
L16  Rating: 200mA  [INDC2012X130L]  (hidden comment: 600R)
L17  Rating: 200mA  [INDC2012X130L]  (hidden comment: 600R)
U2  PPC440EPX-NUA667T  [TE-PBGA680]  (parts J,K of 11)

### Nets
1V5: L8.1 L11.1 L13.2 L14.1 L17.1
1V5_PPC: C111.2 C112.2 C113.2 C114.2 C115.2 C116.2 C117.2 C118.2 C119.2 C120.2 C121.2 C122.2 C123.2 C124.2 C125.2 C126.2 C127.2 C128.2 C129.2 C132.1 C133.1 C136.2 C137.2 C138.2 C139.2 C140.2 C141.2 C142.2 C143.2 C144.2 C145.2 C146.2 C147.2 C148.2 C149.2 C150.2 C151.2 C152.2 C153.2 C154.2 L8.2 L11.2 L14.2 U2.AA5(VDD35) U2.AA16(VDD36) U2.AA19(VDD37) U2.AA30(VDD38) U2.AB5(VDD39) U2.AB16(VDD40) U2.AB19(VDD41) U2.AB30(VDD42) U2.AC5(VDD43) U2.AC30(VDD44) U2.AD5(VDD45) U2.AD30(VDD46) U2.AK11(VDD47) U2.AK12(VDD48) U2.AK13(VDD49) U2.AK14(VDD50) U2.AK15(VDD51) U2.AK20(VDD52) U2.AK21(VDD53) U2.AK22(VDD54) U2.AK23(VDD55) U2.AK24(VDD56) U2.E11(VDD1) U2.E12(VDD2) U2.E13(VDD3) U2.E14(VDD4) U2.E15(VDD5) U2.E20(VDD6) U2.E21(VDD7) U2.E22(VDD8) U2.E23(VDD9) U2.E24(VDD10) U2.L5(VDD11) U2.L30(VDD12) U2.M5(VDD13) U2.M30(VDD14) U2.N5(VDD15) U2.N16(VDD16) U2.N19(VDD17) U2.N30(VDD18) U2.P5(VDD19) U2.P16(VDD20) U2.P19(VDD21) U2.P30(VDD22) U2.R5(VDD23) U2.R30(VDD24) U2.T13(VDD25) U2.T14(VDD26) U2.T21(VDD27) U2.T22(VDD28) U2.W13(VDD29) U2.W14(VDD30) U2.W21(VDD31) U2.W22(VDD32) U2.Y5(VDD33) U2.Y30(VDD34)
1V8: L9.1
1V8_PPC: C61.2 C62.2 C63.2 C64.2 C65.2 C66.2 C67.2 C68.1 C69.1 C70.2 C71.2 C72.2 C73.2 C74.2 C75.2 C76.2 L9.2 U2.AA13(SOVDD2) U2.AB14(SOVDD3) U2.AC2(SOVDD4) U2.AF5(SOVDD5) U2.AH5(SOVDD6) U2.AJ5(SOVDD7) U2.AK2(SOVDD8) U2.AK6(SOVDD9) U2.AK7(SOVDD10) U2.AK9(SOVDD11) U2.AK18(SOVDD12) U2.AN5(SOVDD13) U2.AN12(SOVDD14) U2.V5(SOVDD1)
2V5: L12.1
2V5_PPC: C85.2 C86.2 C87.2 C88.2 C89.2 C90.2 C94.1 C95.1 C96.2 C97.2 C98.2 C99.2 C100.2 C101.2 L12.2 U2.AA22(EOVDD1) U2.AB21(EOVDD2) U2.AC33(EOVDD3) U2.AF30(EOVDD4) U2.AH30(EOVDD5) U2.AJ30(EOVDD6) U2.AK26(EOVDD7) U2.AK28(EOVDD8) U2.AK29(EOVDD9) U2.AK33(EOVDD10) U2.AN23(EOVDD11) U2.AN30(EOVDD12)
3V3: L10.1 L15.1 L16.2
3V3_PPC: C102.2 C103.2 C104.2 C105.2 C106.2 C107.2 C108.2 C109.2 C110.2 C130.1 C131.1 C134.2 C135.2 C155.2 C156.2 C157.2 C158.2 C159.2 C160.2 C161.2 L10.2 U2.B5(OVDD1) U2.B12(OVDD2) U2.B23(OVDD3) U2.B30(OVDD4) U2.E2(OVDD5) U2.E6(OVDD6) U2.E7(OVDD7) U2.E9(OVDD8) U2.E17(OVDD9) U2.E26(OVDD10) U2.E28(OVDD11) U2.E29(OVDD12) U2.E33(OVDD13) U2.F5(OVDD14) U2.F30(OVDD15) U2.G5(OVDD16) U2.G30(OVDD17) U2.J5(OVDD18) U2.J30(OVDD19) U2.M2(OVDD20) U2.M33(OVDD21) U2.N14(OVDD22) U2.N21(OVDD23) U2.P13(OVDD24) U2.P22(OVDD25) U2.U30(OVDD26)
GND: C58.1 C59.1 C60.1 C61.1 C62.1 C63.1 C64.1 C65.1 C66.1 C67.1 C68.2 C69.2 C70.1 C71.1 C72.1 C73.1 C74.1 C75.1 C76.1 C77.1 C78.1 C79.1 C80.1 C81.1 C82.1 C83.1 C84.1 C85.1 C86.1 C87.1 C88.1 C89.1 C90.1 C91.1 C92.1 C93.1 C94.2 C95.2 C96.1 C97.1 C98.1 C99.1 C100.1 C101.1 C102.1 C103.1 C104.1 C105.1 C106.1 C107.1 C108.1 C109.1 C110.1 C111.1 C112.1 C113.1 C114.1 C115.1 C116.1 C117.1 C118.1 C119.1 C120.1 C121.1 C122.1 C123.1 C124.1 C125.1 C126.1 C127.1 C128.1 C129.1 C130.2 C131.2 C132.2 C133.2 C134.1 C135.1 C136.1 C137.1 C138.1 C139.1 C140.1 C141.1 C142.1 C143.1 C144.1 C145.1 C146.1 C147.1 C148.1 C149.1 C150.1 C151.1 C152.1 C153.1 C154.1 C155.1 C156.1 C157.1 C158.1 C159.1 C160.1 C161.1 U2.A1(GND1) U2.A2(GND2) U2.A3(GND3) U2.A28(GND4) U2.A32(GND5) U2.A33(GND6) U2.A34(GND7) U2.AA14(GND128) U2.AA15(GND129) U2.AA17(GND130) U2.AA18(GND131) U2.AA20(GND132) U2.AA21(GND133) U2.AB13(GND134) U2.AB15(GND135) U2.AB17(GND136) U2.AB18(GND137) U2.AB20(GND138) U2.AB22(GND139) U2.AD1(GND140) U2.AE5(GND141) U2.AE30(GND142) U2.AG2(GND143) U2.AG5(GND144) U2.AG30(GND145) U2.AG33(GND146) U2.AJ1(GND147) U2.AK4(GND148) U2.AK5(GND149) U2.AK8(GND150) U2.AK10(GND151) U2.AK16(GND152) U2.AK17(GND153) U2.AK19(GND154) U2.AK25(GND155) U2.AK27(GND156) U2.AK30(GND157) U2.AK31(GND158) U2.AL3(GND159) U2.AL4(GND160) U2.AL5(GND161) U2.AL6(GND162) U2.AL29(GND163) U2.AL30(GND164) U2.AL31(GND165) U2.AL32(GND166) U2.AM1(GND167) U2.AM2(GND168) U2.AM3(GND169) U2.AM4(GND170) U2.AM31(GND171) U2.AM32(GND172) U2.AM33(GND173) U2.AM34(GND174) U2.AN1(GND175) U2.AN2(GND176) U2.AN3(GND177) U2.AN4(GND178) U2.AN8(GND179) U2.AN16(GND180) U2.AN19(GND181) U2.AN27(GND182) U2.AN31(GND183) U2.AN32(GND184) U2.AN33(GND185) U2.AN34(GND186) U2.AP1(GND187) U2.AP2(GND188) U2.AP3(GND189) U2.AP25(AGND) U2.AP27(EAGND) U2.AP32(GND190) U2.AP33(GND191) U2.AP34(GND192) U2.B1(GND8) U2.B2(GND9) U2.B3(GND10) U2.B4(GND11) U2.B8(GND12) U2.B16(GND13) U2.B19(GND14) U2.B26(GND15) U2.B27(GND16) U2.B31(GND17) U2.B32(GND18) U2.B33(GND19) U2.B34(GND20) U2.C2(GND21) U2.C3(GND22) U2.C4(GND23) U2.C31(GND24) U2.C32(GND25) U2.C33(GND26) U2.C34(GND27) U2.D3(GND28) U2.D4(GND29) U2.D5(GND30) U2.D30(GND31) U2.D31(GND32) U2.D32(GND33) U2.D33(GND34) U2.E5(GND35) U2.E8(GND36) U2.E10(GND37) U2.E16(GND38) U2.E18(GND39) U2.E19(GND40) U2.E25(GND41) U2.E27(GND42) U2.E30(GND43) U2.E31(GND44) U2.H1(GND45) U2.H2(GND46) U2.H5(GND47) U2.H30(GND48) U2.H33(GND49) U2.J3(UAGND3) U2.K1(UAGND5) U2.K4(UAGND4) U2.K5(GND50) U2.K30(GND51) U2.M1(UAGND2) U2.M4(UAGND1) U2.N1(GND52) U2.N4(GND53) U2.N13(GND54) U2.N15(GND55) U2.N17(GND56) U2.N18(GND57) U2.N20(GND58) U2.N22(GND59) U2.P14(GND60) U2.P15(GND61) U2.P17(GND62) U2.P18(GND63) U2.P20(GND64) U2.P21(GND65) U2.R13(GND66) U2.R14(GND67) U2.R15(GND68) U2.R16(GND69) U2.R17(GND70) U2.R18(GND71) U2.R19(GND72) U2.R20(GND73) U2.R21(GND74) U2.R22(GND75) U2.T2(GND76) U2.T5(GND77) U2.T15(GND78) U2.T16(GND79) U2.T17(GND80) U2.T18(GND81) U2.T19(GND82) U2.T20(GND83) U2.T30(GND84) U2.T33(GND85) U2.U5(GND86) U2.U13(GND87) U2.U14(GND88) U2.U15(GND89) U2.U16(GND90) U2.U17(GND91) U2.U18(GND92) U2.U19(GND93) U2.U20(GND94) U2.U21(GND95) U2.U22(GND96) U2.V13(GND97) U2.V14(GND98) U2.V15(GND99) U2.V16(GND100) U2.V17(GND101) U2.V18(GND102) U2.V19(GND103) U2.V20(GND104) U2.V21(GND105) U2.V22(GND106) U2.V30(GND107) U2.W2(GND108) U2.W5(GND109) U2.W15(GND110) U2.W16(GND111) U2.W17(GND112) U2.W18(GND113) U2.W19(GND114) U2.W20(GND115) U2.W30(GND116) U2.W33(GND117) U2.Y13(GND118) U2.Y14(GND119) U2.Y15(GND120) U2.Y16(GND121) U2.Y17(GND122) U2.Y18(GND123) U2.Y19(GND124) U2.Y20(GND125) U2.Y21(GND126) U2.Y22(GND127)
NetC58_2: C58.2 C59.2 C60.2 L13.1 U2.AP24(AVDD)
NetC77_2: C77.2 C78.2 C79.2 C80.2 L15.2 U2.L1(UAVDD2) U2.L2(UAVDD1)
NetC81_2: C81.2 C82.2 C83.2 C84.2 L16.1 U2.J4(UAVDD3) U2.L4(UAVDD4)
NetC91_2: C91.2 C92.2 C93.2 L17.2 U2.AP28(EAVDD)

### Notes on the sheet
- (near L12) Place as close to PPC as possible
- (near L13) Place as close to PPC as possible
- Place as close to SOVdd pins as possible
- Note:
  Analogue grounds EAGND, AGND and UAGNDn to be routed to GND pin of decoupling CAP
- (near U2) Place as close to PPC as possible
- Place as close to OVdd pins as possible
- Place as close to Vdd pins as possible
- 2009   THIS DOCUMENT IS THE PROPERTY OF THE OWNER, AND MAY NOT BE COPIED OR USED FOR ANY PURPOSE OTHER THAN THAT FOR WHICH IT IS SUPPLIED WITHOUT PERMISSION IN WRITING FROM THE OWNER.
- C
- DATESTAMP OF THIS PRINT
- DRAWN BY:
- DOCUMENT NUMBER:
- SCHEMATIC FILENAME:
- PCB FILENAME:
- ENGINEER:
- APPROVED:
- CIRCUIT DIAGRAM
- DATE
- SHEET
- REVISION
- OF
- (in symbol IC-CPU-1, part J) POWER_0
- (in symbol IC-CPU-1, part K) POWER_1

### Library data of the parts
C58 C59 C61-C67 C70-C79 C81-C83 C85-C92 C96-C129 C134-C161 = CAP-CER-1: 0.1uF, Ceramic Capacitor; Manufacturer: VENKEL; PartNum: C0402X7R160-104KN; Tolerance: 10%; Dielectric: X7R; POD number: CAP-CER-1; Value: 0.1uF; RoHS: Y; Sort Value: 0.1; Category: Capacitors; Subcategory: Ceramic
C60 C80 C84 C93 = CAP-CER-4: 1000pF, Ceramic Capacitor; Manufacturer: MURATA; PartNum: GRM155R61H102KA01D; Tolerance: 10%; Dielectric: X5R; POD number: CAP-CER-4; Value: 1000pF; RoHS: Y; Sort Value: 0.0001; Category: Capacitors; Subcategory: Ceramic
C68 C69 C94 C95 C130-C133 = CAP-TAN-6: as C673-C678 on sheet zdoks; POD number: CAP-TAN-6; Value: 100uF; RoHS: Y; Sort Value: 100; Category: Capacitors; Subcategory: Tantalum
L8 L11 L14 = IND-FB-2: 180 Ohm, Chip Ferrite Brad; Manufacturer: Murata; PartNum: BLM18PG181SN1; DC Res: 0.09R; Tolerance: 25%; POD number: IND-FB-2; RoHS: Y; Value: 180R; Sort Value: 180; Category: Inductors; Subcategory: FerriteBead
L9 L10 L12 L13 L15-L17 = IND-FB-0: 600 Ohm, Chip Ferrite Bead; Manufacturer: Murata; PartNum: BLM21BD601SN1; DC Res: 0.35R; Tolerance: 25%; POD number: IND-FB-0; RoHS: Y; Value: 600R; Sort Value: 600; Category: Inductors; Subcategory: FerriteBead
U2 = IC-CPU-1: 667MHz, non-RoHS, PPC440EPx uProcessor; Manufacturer: Applied Micro; POD number: IC-CPU-1; PartNum: PPC440EPX-NUA667T; RoHS: Y; Category: IC; Subcategory: CPU